# Altium schematic sheet BitFury.SchDoc
size A1
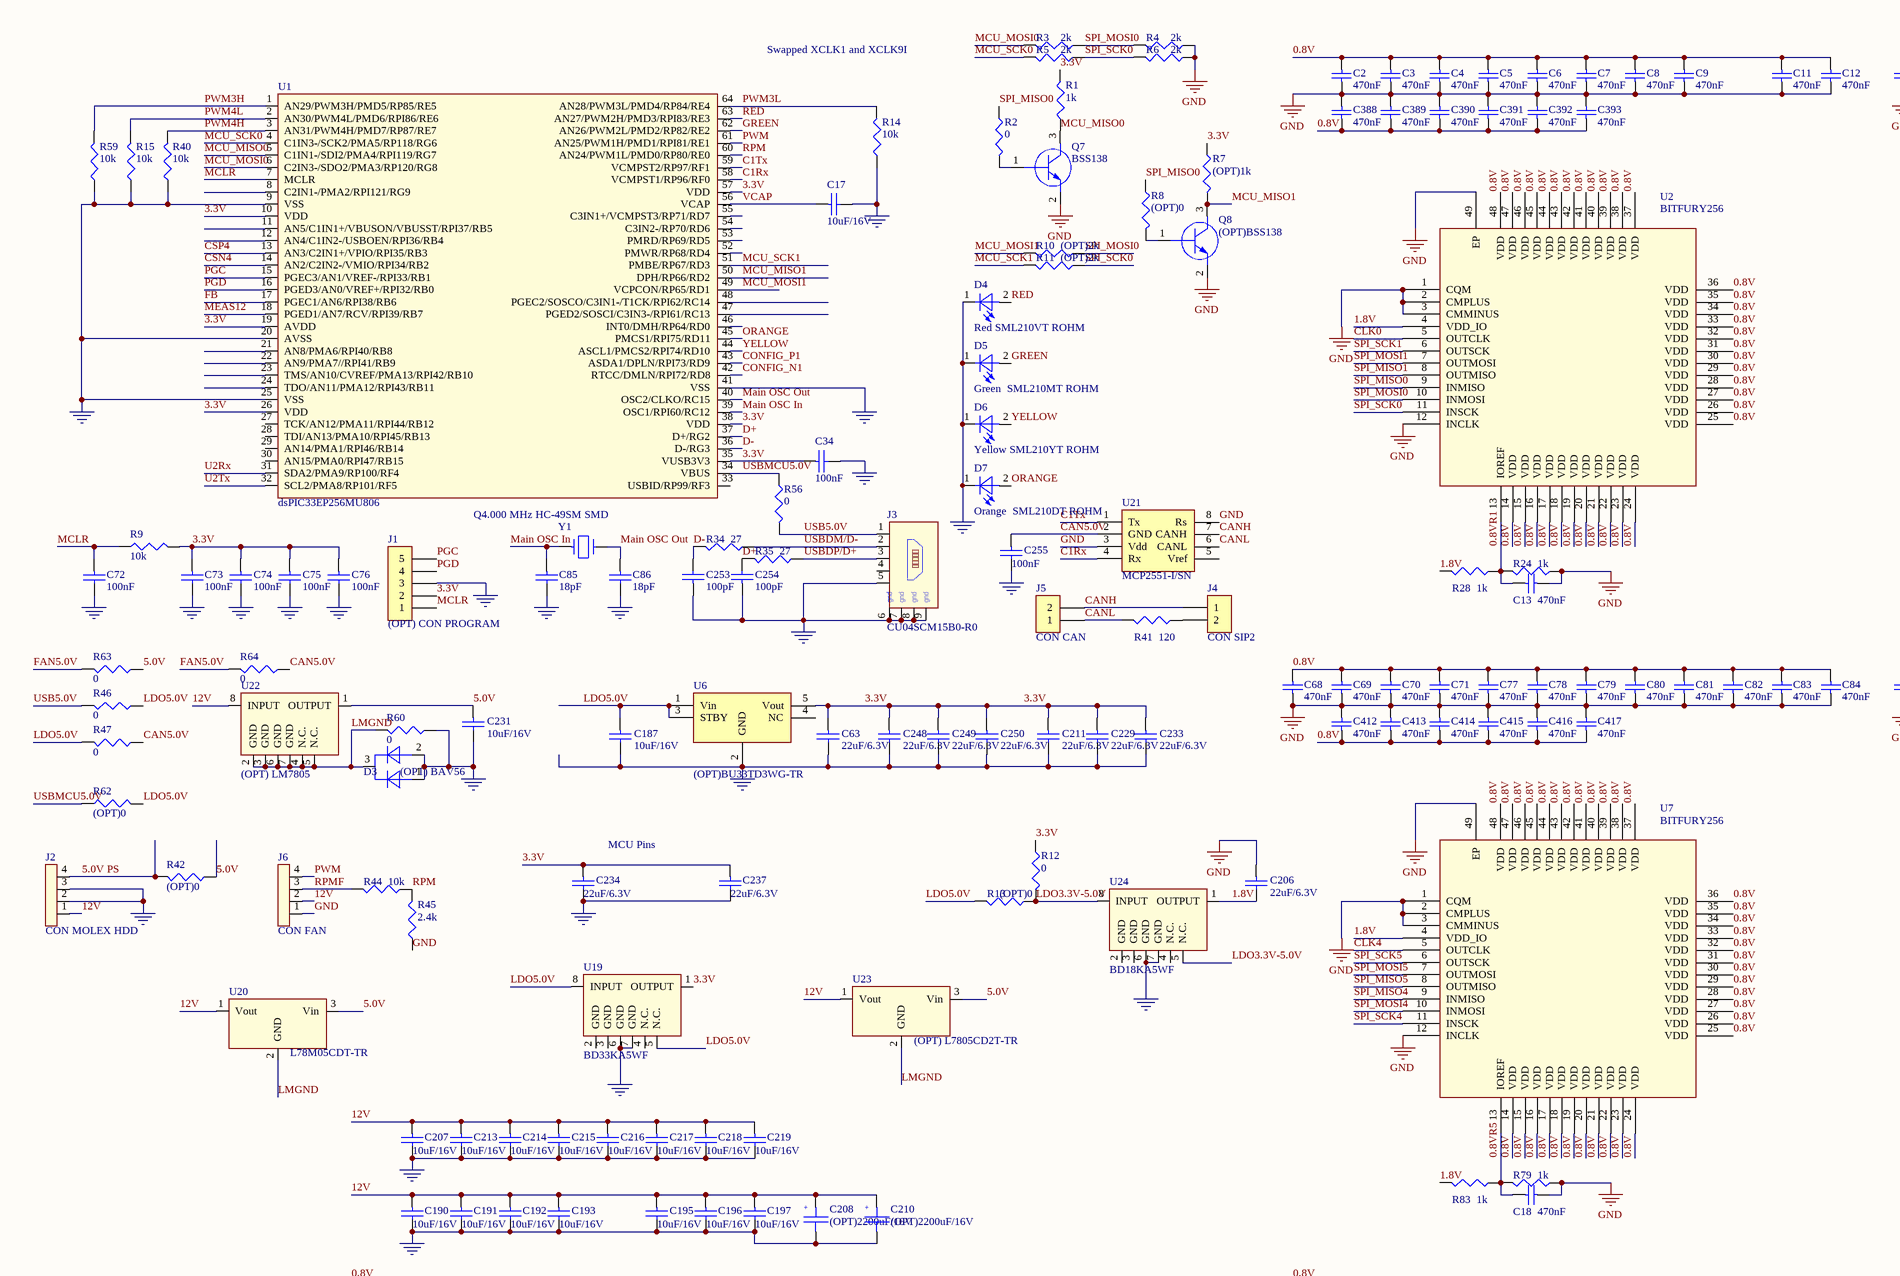
[diagram p0: BitFury.SchDoc, top left]
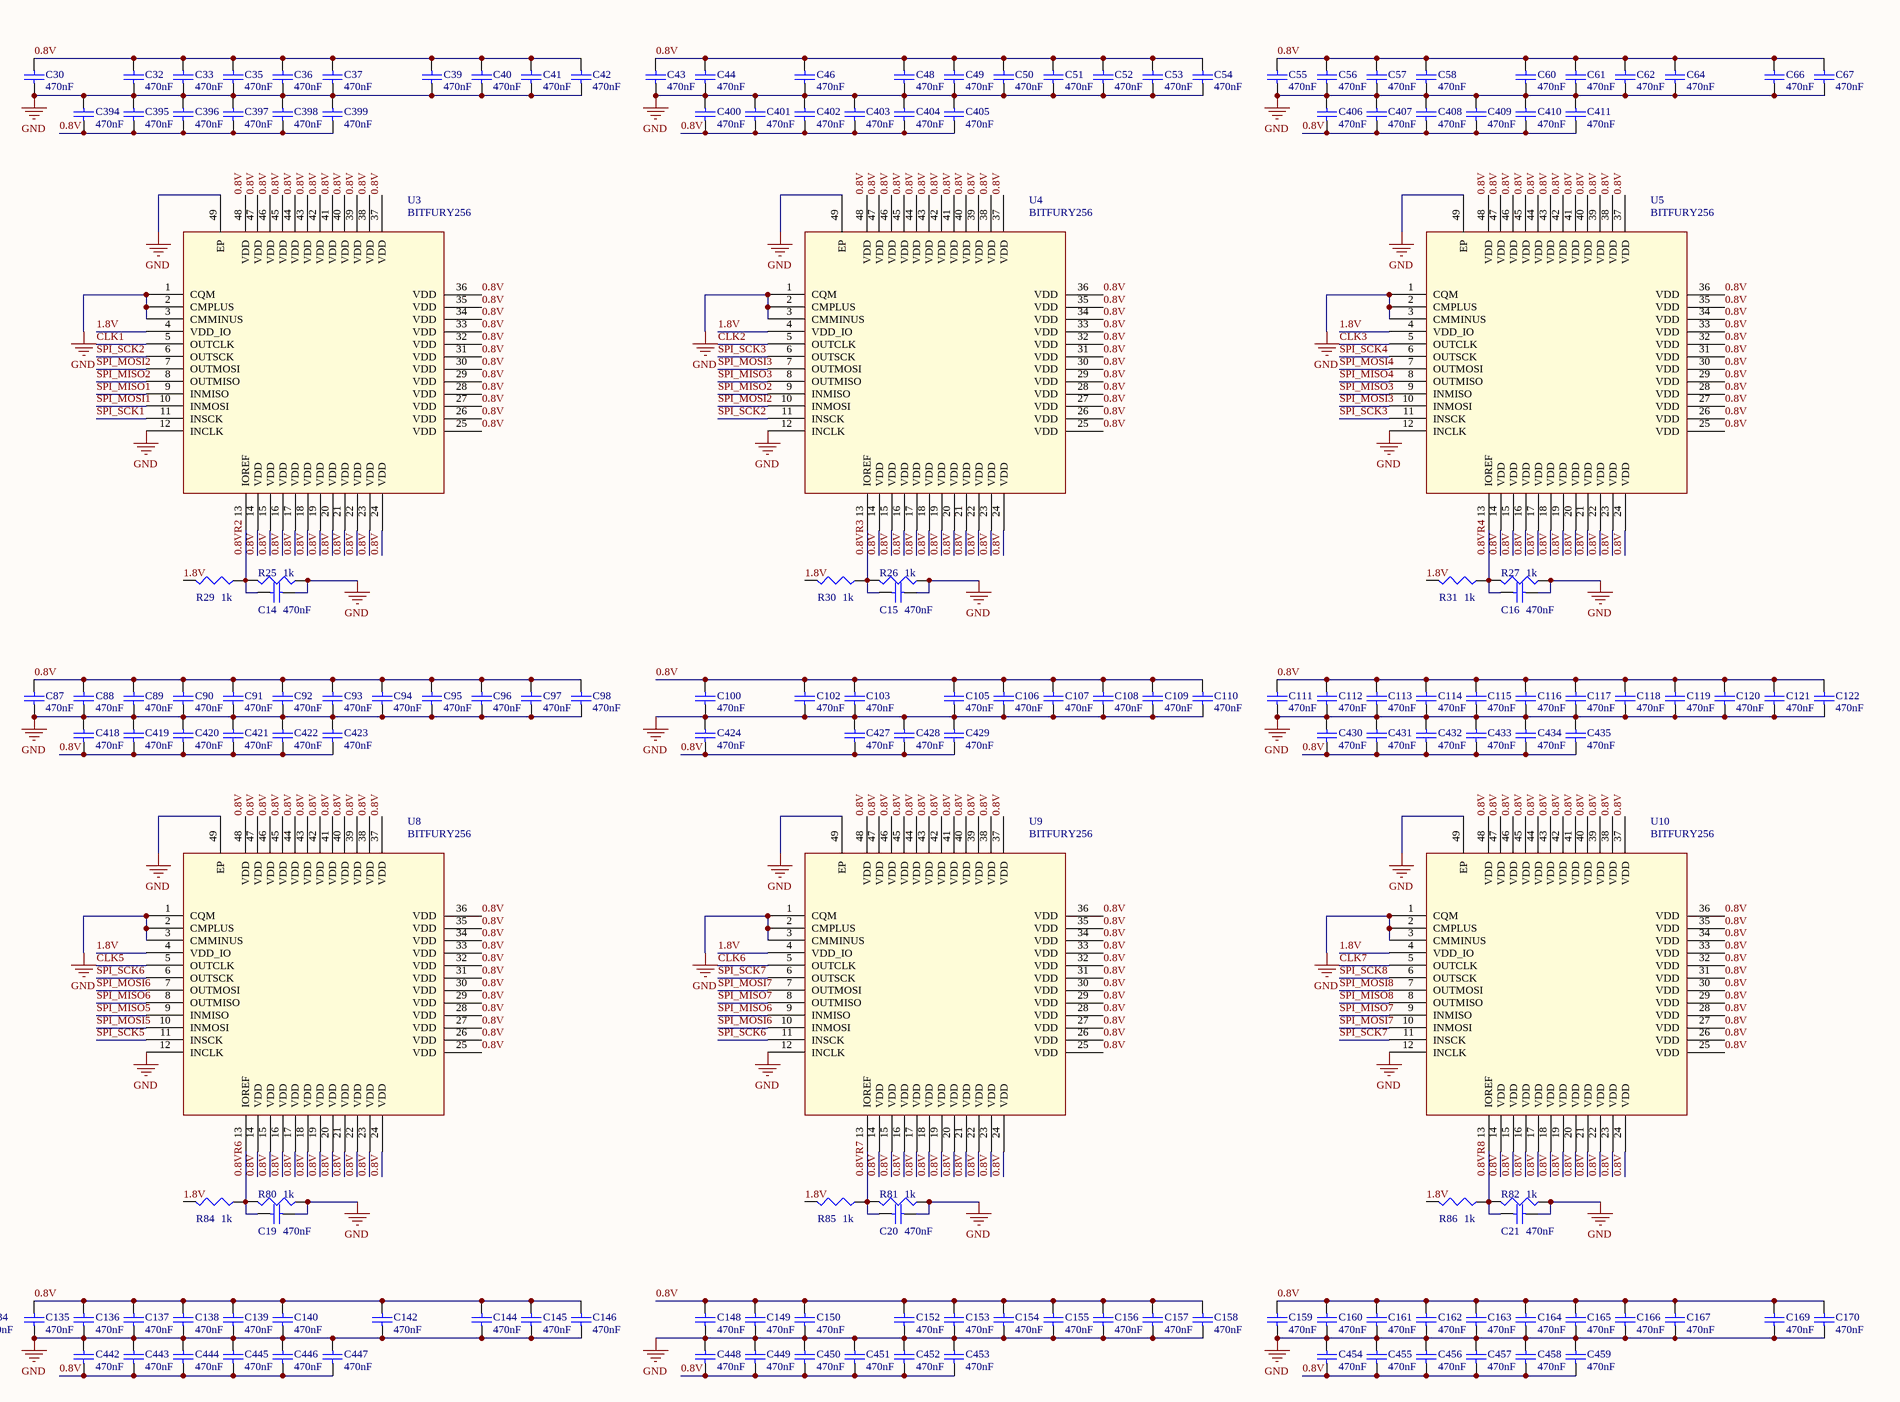
[diagram p1: BitFury.SchDoc, top right]
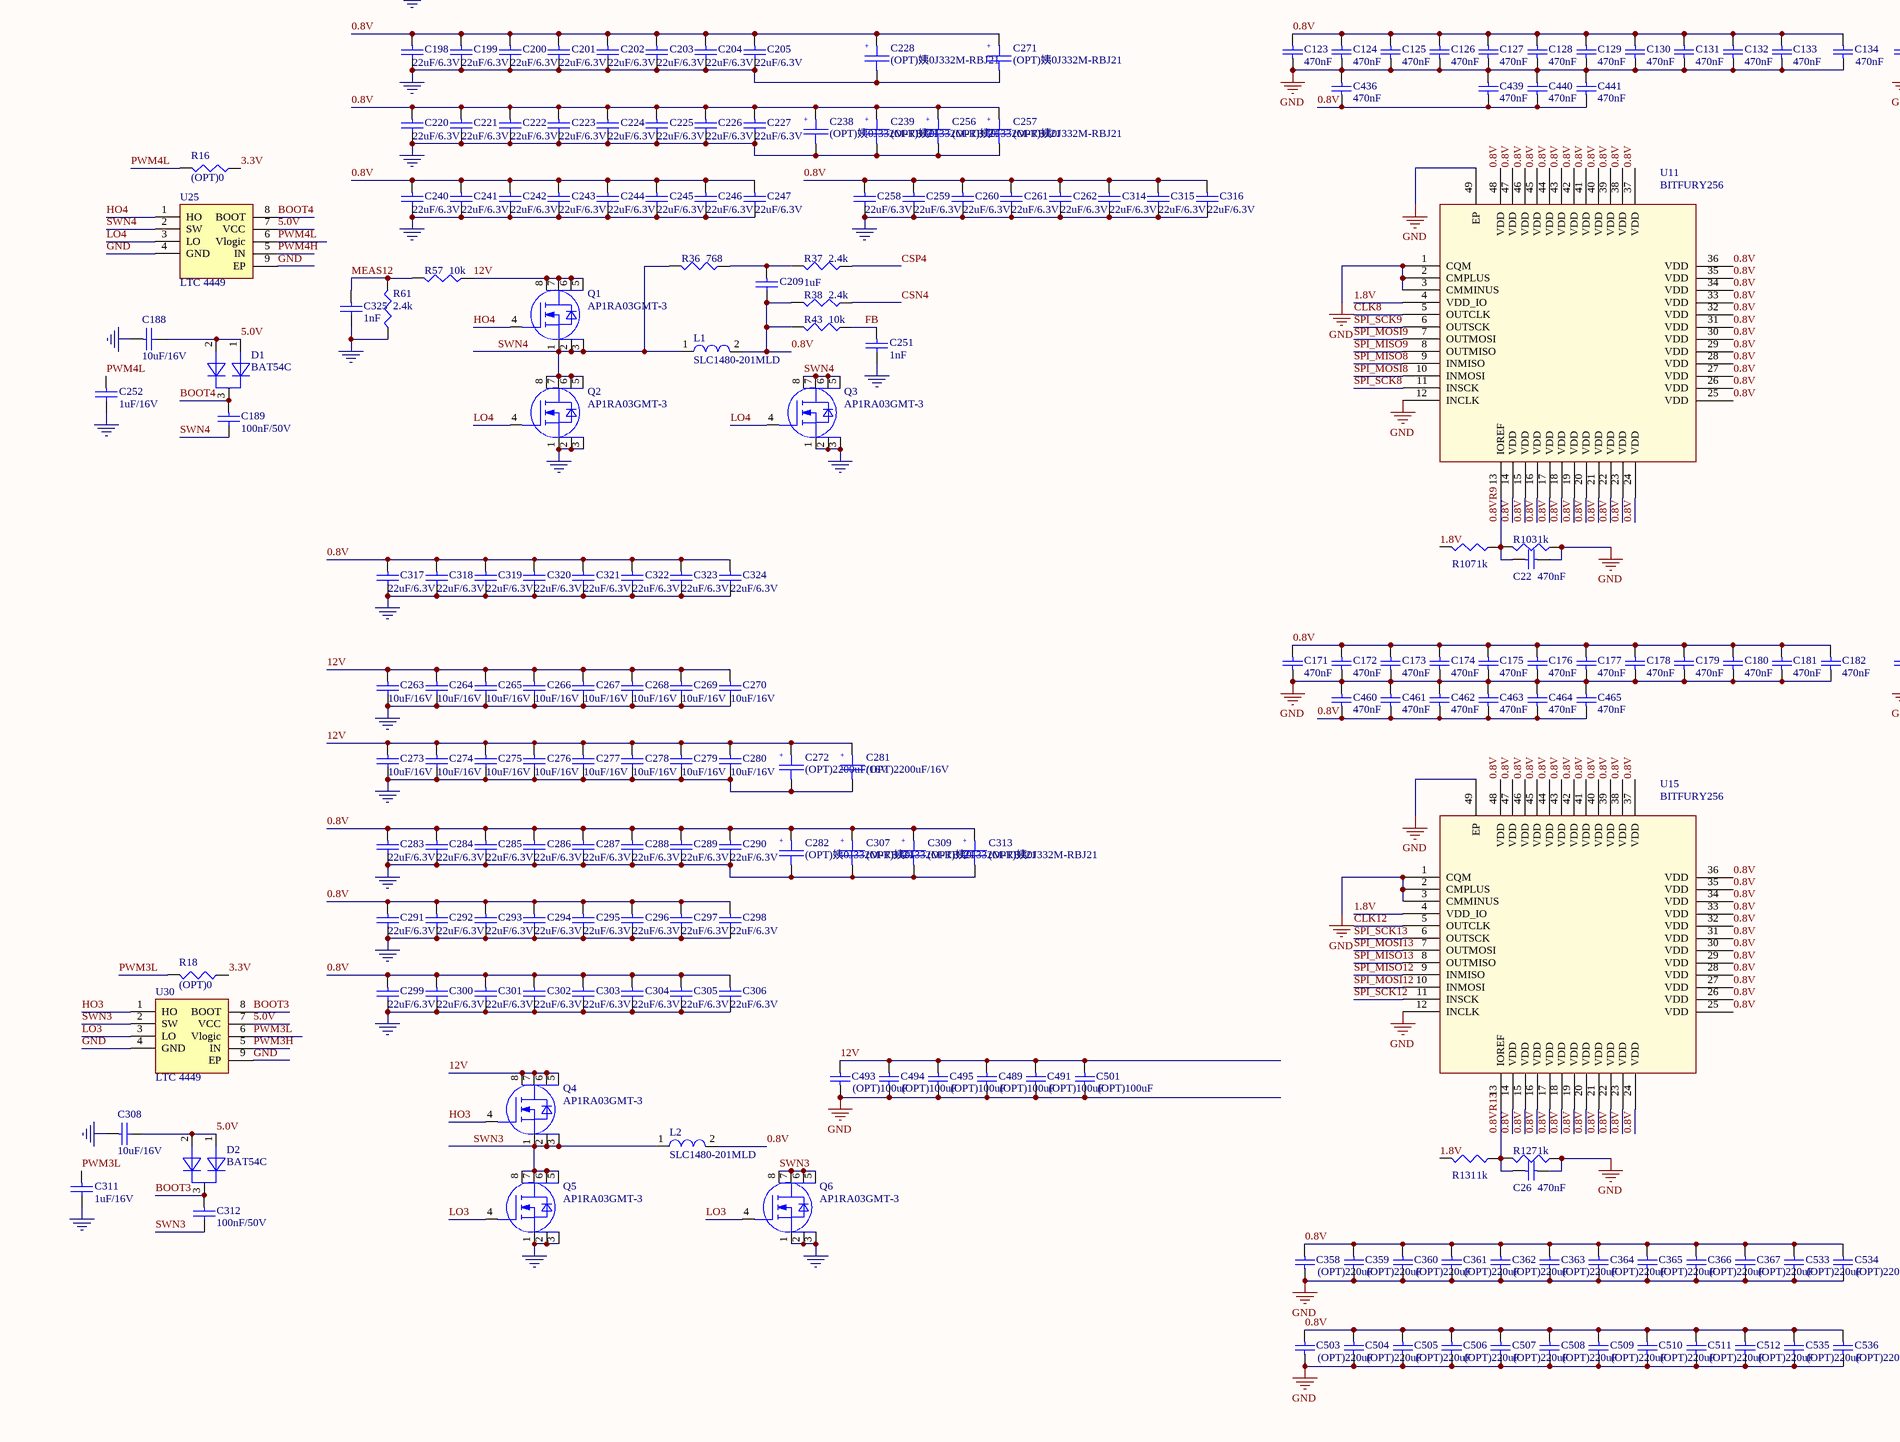
[diagram p2: BitFury.SchDoc, bottom left]
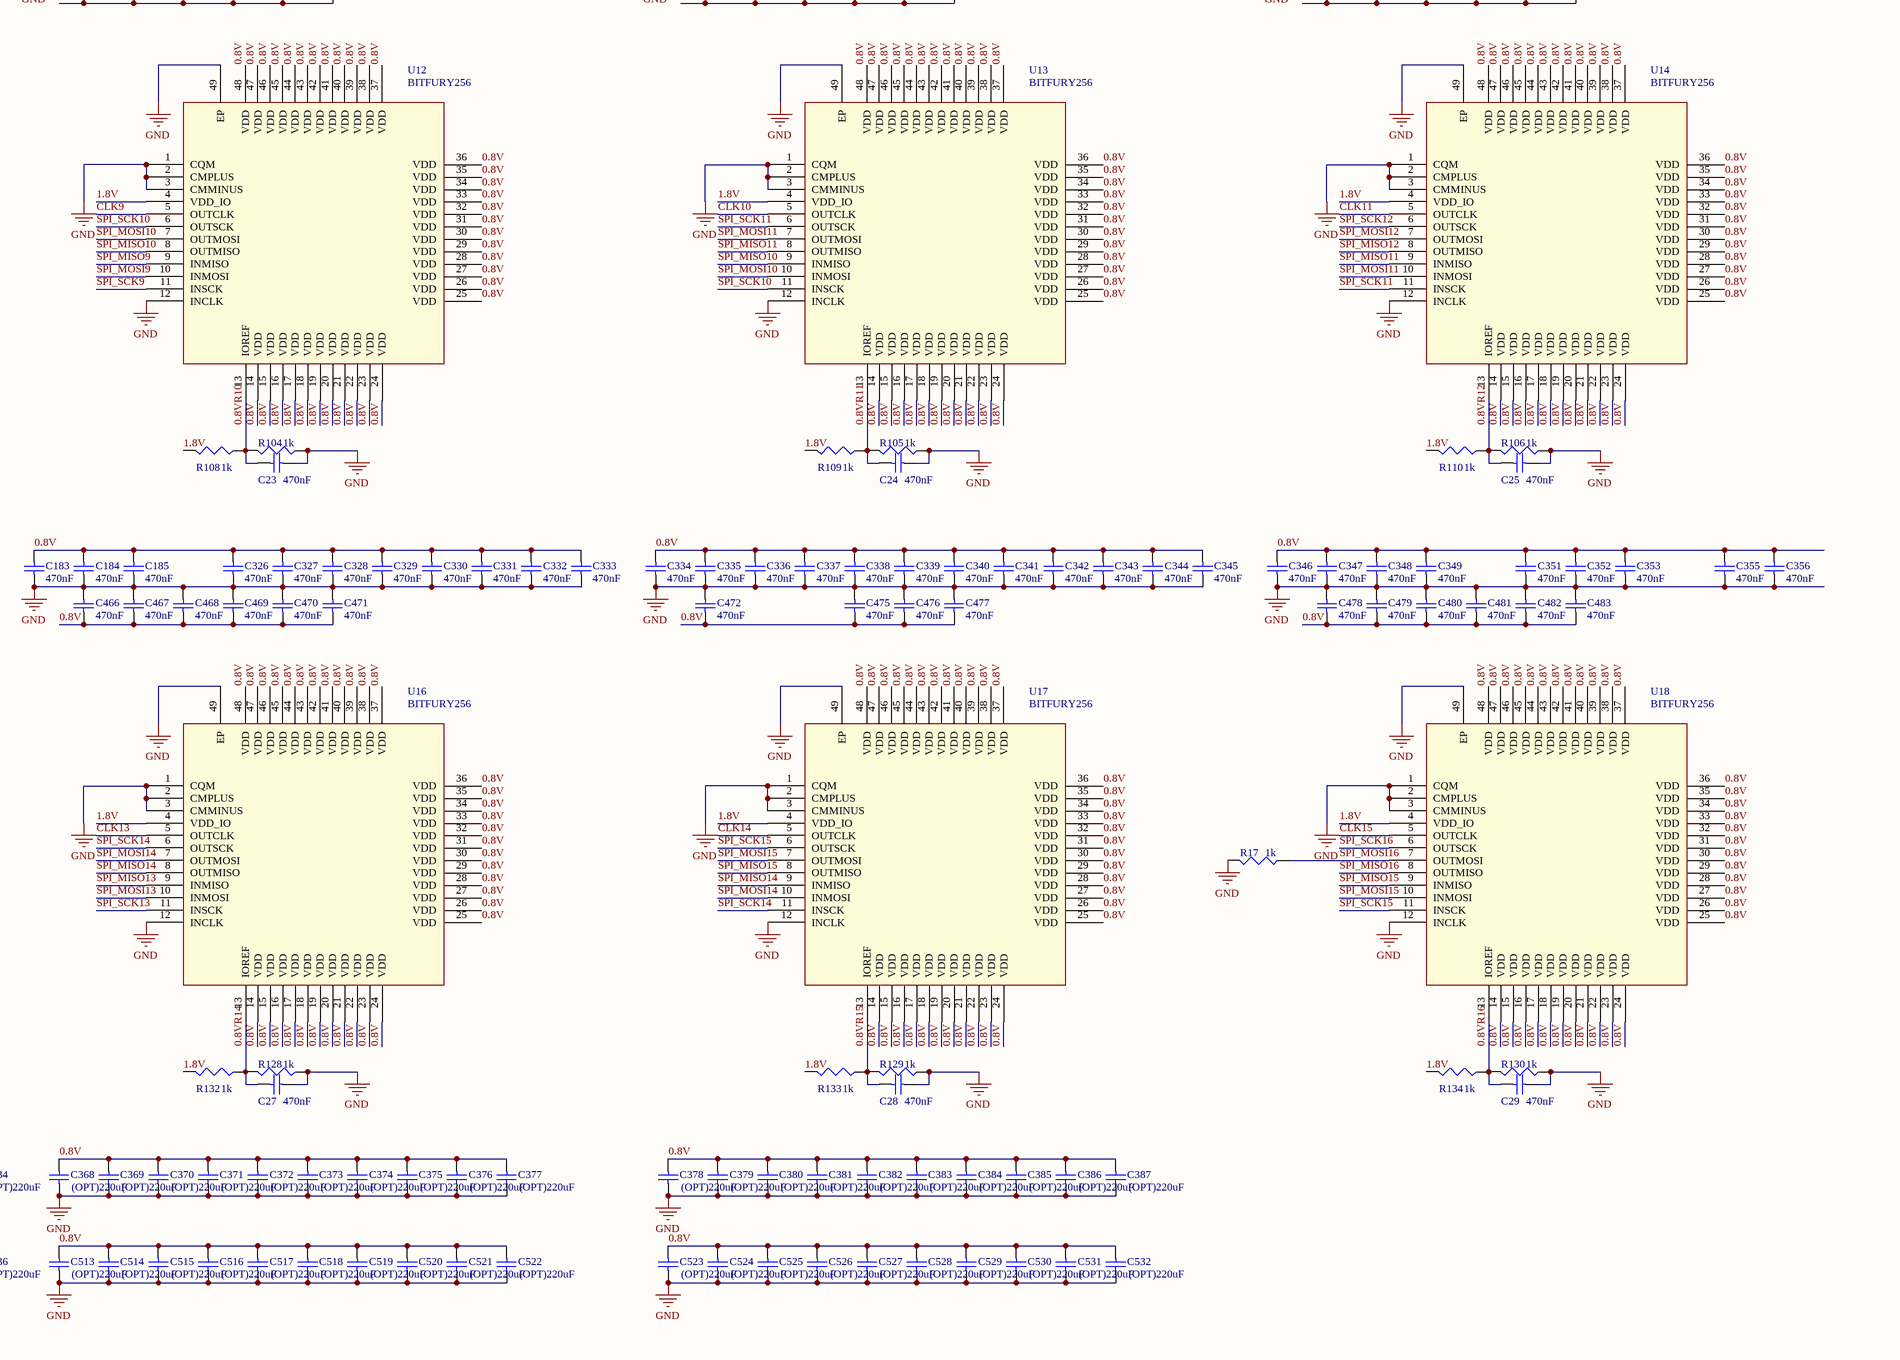
[diagram p3: BitFury.SchDoc, bottom right]

## Parts
C2  470nF  [SMD_0603_CAPC1608X80N]
C3  470nF  [SMD_0603_CAPC1608X80N]
C4  470nF  [SMD_0603_CAPC1608X80N]
C5  470nF  [SMD_0603_CAPC1608X80N]
C6  470nF  [SMD_0603_CAPC1608X80N]
C7  470nF  [SMD_0603_CAPC1608X80N]
C8  470nF  [SMD_0603_CAPC1608X80N]
C9  470nF  [SMD_0603_CAPC1608X80N]
C11  470nF  [SMD_0603_CAPC1608X80N]
C12  470nF  [SMD_0603_CAPC1608X80N]
C13  470nF  [SMD_0603_CAPC1608X80N]
C14  470nF  [SMD_0603_CAPC1608X80N]
C15  470nF  [SMD_0603_CAPC1608X80N]
C16  470nF  [SMD_0603_CAPC1608X80N]
C17  10uF/16V  [SMD_0805_CAPC2012X145N]
C18  470nF  [SMD_0603_CAPC1608X80N]
C19  470nF  [SMD_0603_CAPC1608X80N]
C20  470nF  [SMD_0603_CAPC1608X80N]
C21  470nF  [SMD_0603_CAPC1608X80N]
C22  470nF  [SMD_0603_CAPC1608X80N]
C23  470nF  [SMD_0603_CAPC1608X80N]
C24  470nF  [SMD_0603_CAPC1608X80N]
C25  470nF  [SMD_0603_CAPC1608X80N]
C26  470nF  [SMD_0603_CAPC1608X80N]
C27  470nF  [SMD_0603_CAPC1608X80N]
C28  470nF  [SMD_0603_CAPC1608X80N]
C29  470nF  [SMD_0603_CAPC1608X80N]
C30  470nF  [SMD_0603_CAPC1608X80N]
C32  470nF  [SMD_0603_CAPC1608X80N]
C33  470nF  [SMD_0603_CAPC1608X80N]
C34  100nF  [SMD_0603_CAPC1608X80N]
C35  470nF  [SMD_0603_CAPC1608X80N]
C36  470nF  [SMD_0603_CAPC1608X80N]
C37  470nF  [SMD_0603_CAPC1608X80N]
C39  470nF  [SMD_0603_CAPC1608X80N]
C40  470nF  [SMD_0603_CAPC1608X80N]
C41  470nF  [SMD_0603_CAPC1608X80N]
C42  470nF  [SMD_0603_CAPC1608X80N]
C43  470nF  [SMD_0603_CAPC1608X80N]
C44  470nF  [SMD_0603_CAPC1608X80N]
C46  470nF  [SMD_0603_CAPC1608X80N]
C48  470nF  [SMD_0603_CAPC1608X80N]
C49  470nF  [SMD_0603_CAPC1608X80N]
C50  470nF  [SMD_0603_CAPC1608X80N]
C51  470nF  [SMD_0603_CAPC1608X80N]
C52  470nF  [SMD_0603_CAPC1608X80N]
C53  470nF  [SMD_0603_CAPC1608X80N]
C54  470nF  [SMD_0603_CAPC1608X80N]
C55  470nF  [SMD_0603_CAPC1608X80N]
C56  470nF  [SMD_0603_CAPC1608X80N]
C57  470nF  [SMD_0603_CAPC1608X80N]
C58  470nF  [SMD_0603_CAPC1608X80N]
C60  470nF  [SMD_0603_CAPC1608X80N]
C61  470nF  [SMD_0603_CAPC1608X80N]
C62  470nF  [SMD_0603_CAPC1608X80N]
C63  22uF/6.3V  [SMD_0805_CAPC2012X145N]
C64  470nF  [SMD_0603_CAPC1608X80N]
C66  470nF  [SMD_0603_CAPC1608X80N]
C67  470nF  [SMD_0603_CAPC1608X80N]
C68  470nF  [SMD_0603_CAPC1608X80N]
C69  470nF  [SMD_0603_CAPC1608X80N]
C70  470nF  [SMD_0603_CAPC1608X80N]
C71  470nF  [SMD_0603_CAPC1608X80N]
C72  100nF  [SMD_0603_CAPC1608X80N]
C73  100nF  [SMD_0603_CAPC1608X80N]
C74  100nF  [SMD_0603_CAPC1608X80N]
C75  100nF  [SMD_0603_CAPC1608X80N]
C76  100nF  [SMD_0603_CAPC1608X80N]
C77  470nF  [SMD_0603_CAPC1608X80N]
C78  470nF  [SMD_0603_CAPC1608X80N]
C79  470nF  [SMD_0603_CAPC1608X80N]
C80  470nF  [SMD_0603_CAPC1608X80N]
C81  470nF  [SMD_0603_CAPC1608X80N]
C82  470nF  [SMD_0603_CAPC1608X80N]
C83  470nF  [SMD_0603_CAPC1608X80N]
C84  470nF  [SMD_0603_CAPC1608X80N]
C85  18pF  [SMD_0603_CAPC1608X80N]
C86  18pF  [SMD_0603_CAPC1608X80N]
C87  470nF  [SMD_0603_CAPC1608X80N]
C88  470nF  [SMD_0603_CAPC1608X80N]
C89  470nF  [SMD_0603_CAPC1608X80N]
C90  470nF  [SMD_0603_CAPC1608X80N]
C91  470nF  [SMD_0603_CAPC1608X80N]
C92  470nF  [SMD_0603_CAPC1608X80N]
C93  470nF  [SMD_0603_CAPC1608X80N]
C94  470nF  [SMD_0603_CAPC1608X80N]
C95  470nF  [SMD_0603_CAPC1608X80N]
C96  470nF  [SMD_0603_CAPC1608X80N]
C97  470nF  [SMD_0603_CAPC1608X80N]
C98  470nF  [SMD_0603_CAPC1608X80N]
C100  470nF  [SMD_0603_CAPC1608X80N]
C102  470nF  [SMD_0603_CAPC1608X80N]
C103  470nF  [SMD_0603_CAPC1608X80N]
C105  470nF  [SMD_0603_CAPC1608X80N]
C106  470nF  [SMD_0603_CAPC1608X80N]
C107  470nF  [SMD_0603_CAPC1608X80N]
C108  470nF  [SMD_0603_CAPC1608X80N]
C109  470nF  [SMD_0603_CAPC1608X80N]
C110  470nF  [SMD_0603_CAPC1608X80N]
C111  470nF  [SMD_0603_CAPC1608X80N]
C112  470nF  [SMD_0603_CAPC1608X80N]
C113  470nF  [SMD_0603_CAPC1608X80N]
C114  470nF  [SMD_0603_CAPC1608X80N]
C115  470nF  [SMD_0603_CAPC1608X80N]
C116  470nF  [SMD_0603_CAPC1608X80N]
C117  470nF  [SMD_0603_CAPC1608X80N]
C118  470nF  [SMD_0603_CAPC1608X80N]
C119  470nF  [SMD_0603_CAPC1608X80N]
C120  470nF  [SMD_0603_CAPC1608X80N]
C121  470nF  [SMD_0603_CAPC1608X80N]
C122  470nF  [SMD_0603_CAPC1608X80N]
C123  470nF  [SMD_0603_CAPC1608X80N]
C124  470nF  [SMD_0603_CAPC1608X80N]
C125  470nF  [SMD_0603_CAPC1608X80N]
C126  470nF  [SMD_0603_CAPC1608X80N]
C127  470nF  [SMD_0603_CAPC1608X80N]
C128  470nF  [SMD_0603_CAPC1608X80N]
C129  470nF  [SMD_0603_CAPC1608X80N]
C130  470nF  [SMD_0603_CAPC1608X80N]
C131  470nF  [SMD_0603_CAPC1608X80N]
C132  470nF  [SMD_0603_CAPC1608X80N]
C133  470nF  [SMD_0603_CAPC1608X80N]
C134  470nF  [SMD_0603_CAPC1608X80N]
C135  470nF  [SMD_0603_CAPC1608X80N]
C136  470nF  [SMD_0603_CAPC1608X80N]
C137  470nF  [SMD_0603_CAPC1608X80N]
C138  470nF  [SMD_0603_CAPC1608X80N]
C139  470nF  [SMD_0603_CAPC1608X80N]
C140  470nF  [SMD_0603_CAPC1608X80N]
C142  470nF  [SMD_0603_CAPC1608X80N]
C144  470nF  [SMD_0603_CAPC1608X80N]
C145  470nF  [SMD_0603_CAPC1608X80N]
C146  470nF  [SMD_0603_CAPC1608X80N]
C148  470nF  [SMD_0603_CAPC1608X80N]
C149  470nF  [SMD_0603_CAPC1608X80N]
C150  470nF  [SMD_0603_CAPC1608X80N]
C152  470nF  [SMD_0603_CAPC1608X80N]
C153  470nF  [SMD_0603_CAPC1608X80N]
C154  470nF  [SMD_0603_CAPC1608X80N]
C155  470nF  [SMD_0603_CAPC1608X80N]
C156  470nF  [SMD_0603_CAPC1608X80N]
C157  470nF  [SMD_0603_CAPC1608X80N]
C158  470nF  [SMD_0603_CAPC1608X80N]
C159  470nF  [SMD_0603_CAPC1608X80N]
C160  470nF  [SMD_0603_CAPC1608X80N]
C161  470nF  [SMD_0603_CAPC1608X80N]
C162  470nF  [SMD_0603_CAPC1608X80N]
C163  470nF  [SMD_0603_CAPC1608X80N]
C164  470nF  [SMD_0603_CAPC1608X80N]
C165  470nF  [SMD_0603_CAPC1608X80N]
C166  470nF  [SMD_0603_CAPC1608X80N]
C167  470nF  [SMD_0603_CAPC1608X80N]
C169  470nF  [SMD_0603_CAPC1608X80N]
C170  470nF  [SMD_0603_CAPC1608X80N]
C171  470nF  [SMD_0603_CAPC1608X80N]
C172  470nF  [SMD_0603_CAPC1608X80N]
C173  470nF  [SMD_0603_CAPC1608X80N]
C174  470nF  [SMD_0603_CAPC1608X80N]
C175  470nF  [SMD_0603_CAPC1608X80N]
C176  470nF  [SMD_0603_CAPC1608X80N]
C177  470nF  [SMD_0603_CAPC1608X80N]
C178  470nF  [SMD_0603_CAPC1608X80N]
C179  470nF  [SMD_0603_CAPC1608X80N]
C180  470nF  [SMD_0603_CAPC1608X80N]
C181  470nF  [SMD_0603_CAPC1608X80N]
C182  470nF  [SMD_0603_CAPC1608X80N]
C183  470nF  [SMD_0603_CAPC1608X80N]
C184  470nF  [SMD_0603_CAPC1608X80N]
C185  470nF  [SMD_0603_CAPC1608X80N]
C187  10uF/16V  [SMD_0805_CAPC2012X145N]
C188  10uF/16V  [SMD_0805_CAPC2012X145N]
C189  100nF/50V  [SMD_0805_CAPC2012X145N]
C190  10uF/16V  [SMD_0805_CAPC2012X145N]
C191  10uF/16V  [SMD_0805_CAPC2012X145N]
C192  10uF/16V  [SMD_0805_CAPC2012X145N]
C193  10uF/16V  [SMD_0805_CAPC2012X145N]
C195  10uF/16V  [SMD_0805_CAPC2012X145N]
C196  10uF/16V  [SMD_0805_CAPC2012X145N]
C197  10uF/16V  [SMD_0805_CAPC2012X145N]
C198  22uF/6.3V  [SMD_0805_CAPC2012X145N]
C199  22uF/6.3V  [SMD_0805_CAPC2012X145N]
C200  22uF/6.3V  [SMD_0805_CAPC2012X145N]
C201  22uF/6.3V  [SMD_0805_CAPC2012X145N]
C202  22uF/6.3V  [SMD_0805_CAPC2012X145N]
C203  22uF/6.3V  [SMD_0805_CAPC2012X145N]
C204  22uF/6.3V  [SMD_0805_CAPC2012X145N]
C205  22uF/6.3V  [SMD_0805_CAPC2012X145N]
C206  22uF/6.3V  [SMD_0805_CAPC2012X145N]
C207  10uF/16V  [SMD_0805_CAPC2012X145N]
C208  (OPT)2200uF/16V  [PTH_CAPPR500-1300X2250]
C209  1uF  [SMD_0805_CAPC2012X145N]
C210  (OPT)2200uF/16V  [PTH_CAPPR500-1300X2250]
C211  22uF/6.3V  [SMD_0805_CAPC2012X145N]
C213  10uF/16V  [SMD_0805_CAPC2012X145N]
C214  10uF/16V  [SMD_0805_CAPC2012X145N]
C215  10uF/16V  [SMD_0805_CAPC2012X145N]
C216  10uF/16V  [SMD_0805_CAPC2012X145N]
C217  10uF/16V  [SMD_0805_CAPC2012X145N]
C218  10uF/16V  [SMD_0805_CAPC2012X145N]
C219  10uF/16V  [SMD_0805_CAPC2012X145N]
C220  22uF/6.3V  [SMD_0805_CAPC2012X145N]
C221  22uF/6.3V  [SMD_0805_CAPC2012X145N]
C222  22uF/6.3V  [SMD_0805_CAPC2012X145N]
C223  22uF/6.3V  [SMD_0805_CAPC2012X145N]
C224  22uF/6.3V  [SMD_0805_CAPC2012X145N]
C225  22uF/6.3V  [SMD_0805_CAPC2012X145N]
C226  22uF/6.3V  [SMD_0805_CAPC2012X145N]
C227  22uF/6.3V  [SMD_0805_CAPC2012X145N]
C228  (OPT)姨0J332M-RBJ21  [PTH_CAPPR500-1300X2250]
C229  22uF/6.3V  [SMD_0805_CAPC2012X145N]
C231  10uF/16V  [SMD_0805_CAPC2012X145N]
C233  22uF/6.3V  [SMD_0805_CAPC2012X145N]
C234  22uF/6.3V  [SMD_0805_CAPC2012X145N]
C237  22uF/6.3V  [SMD_0805_CAPC2012X145N]
C238  (OPT)姨0J332M-RBJ21  [PTH_CAPPR500-1300X2250]
C239  (OPT)姨0J332M-RBJ21  [PTH_CAPPR500-1300X2250]
C240  22uF/6.3V  [SMD_0805_CAPC2012X145N]
C241  22uF/6.3V  [SMD_0805_CAPC2012X145N]
C242  22uF/6.3V  [SMD_0805_CAPC2012X145N]
C243  22uF/6.3V  [SMD_0805_CAPC2012X145N]
C244  22uF/6.3V  [SMD_0805_CAPC2012X145N]
C245  22uF/6.3V  [SMD_0805_CAPC2012X145N]
C246  22uF/6.3V  [SMD_0805_CAPC2012X145N]
C247  22uF/6.3V  [SMD_0805_CAPC2012X145N]
C248  22uF/6.3V  [SMD_0805_CAPC2012X145N]
C249  22uF/6.3V  [SMD_0805_CAPC2012X145N]
C250  22uF/6.3V  [SMD_0805_CAPC2012X145N]
C251  1nF  [SMD_0603_CAPC1608X80N]
C252  1uF/16V  [SMD_0805_CAPC2012X145N]
C253  100pF  [SMD_0603_CAPC1608X80N]
C254  100pF  [SMD_0603_CAPC1608X80N]
C255  100nF  [SMD_0603_CAPC1608X80N]
C256  (OPT)姨0J332M-RBJ21  [PTH_CAPPR500-1300X2250]
C257  (OPT)姨0J332M-RBJ21  [PTH_CAPPR500-1300X2250]
C258  22uF/6.3V  [SMD_0805_CAPC2012X145N]
C259  22uF/6.3V  [SMD_0805_CAPC2012X145N]
C260  22uF/6.3V  [SMD_0805_CAPC2012X145N]
C261  22uF/6.3V  [SMD_0805_CAPC2012X145N]
C262  22uF/6.3V  [SMD_0805_CAPC2012X145N]
C263  10uF/16V  [SMD_0805_CAPC2012X145N]
C264  10uF/16V  [SMD_0805_CAPC2012X145N]
C265  10uF/16V  [SMD_0805_CAPC2012X145N]
C266  10uF/16V  [SMD_0805_CAPC2012X145N]
C267  10uF/16V  [SMD_0805_CAPC2012X145N]
C268  10uF/16V  [SMD_0805_CAPC2012X145N]
C269  10uF/16V  [SMD_0805_CAPC2012X145N]
C270  10uF/16V  [SMD_0805_CAPC2012X145N]
C271  (OPT)姨0J332M-RBJ21  [PTH_CAPPR500-1300X2250]
C272  (OPT)2200uF/16V  [PTH_CAPPR500-1300X2250]
C273  10uF/16V  [SMD_0805_CAPC2012X145N]
C274  10uF/16V  [SMD_0805_CAPC2012X145N]
C275  10uF/16V  [SMD_0805_CAPC2012X145N]
C276  10uF/16V  [SMD_0805_CAPC2012X145N]
C277  10uF/16V  [SMD_0805_CAPC2012X145N]
C278  10uF/16V  [SMD_0805_CAPC2012X145N]
C279  10uF/16V  [SMD_0805_CAPC2012X145N]
C280  10uF/16V  [SMD_0805_CAPC2012X145N]
C281  (OPT)2200uF/16V  [PTH_CAPPR500-1300X2250]
C282  (OPT)姨0J332M-RBJ21  [PTH_CAPPR500-1300X2250]
C283  22uF/6.3V  [SMD_0805_CAPC2012X145N]
C284  22uF/6.3V  [SMD_0805_CAPC2012X145N]
C285  22uF/6.3V  [SMD_0805_CAPC2012X145N]
C286  22uF/6.3V  [SMD_0805_CAPC2012X145N]
C287  22uF/6.3V  [SMD_0805_CAPC2012X145N]
C288  22uF/6.3V  [SMD_0805_CAPC2012X145N]
C289  22uF/6.3V  [SMD_0805_CAPC2012X145N]
C290  22uF/6.3V  [SMD_0805_CAPC2012X145N]
C291  22uF/6.3V  [SMD_0805_CAPC2012X145N]
C292  22uF/6.3V  [SMD_0805_CAPC2012X145N]
C293  22uF/6.3V  [SMD_0805_CAPC2012X145N]
C294  22uF/6.3V  [SMD_0805_CAPC2012X145N]
C295  22uF/6.3V  [SMD_0805_CAPC2012X145N]
C296  22uF/6.3V  [SMD_0805_CAPC2012X145N]
C297  22uF/6.3V  [SMD_0805_CAPC2012X145N]
C298  22uF/6.3V  [SMD_0805_CAPC2012X145N]
C299  22uF/6.3V  [SMD_0805_CAPC2012X145N]
C300  22uF/6.3V  [SMD_0805_CAPC2012X145N]
C301  22uF/6.3V  [SMD_0805_CAPC2012X145N]
C302  22uF/6.3V  [SMD_0805_CAPC2012X145N]
C303  22uF/6.3V  [SMD_0805_CAPC2012X145N]
C304  22uF/6.3V  [SMD_0805_CAPC2012X145N]
C305  22uF/6.3V  [SMD_0805_CAPC2012X145N]
C306  22uF/6.3V  [SMD_0805_CAPC2012X145N]
C307  (OPT)姨0J332M-RBJ21  [PTH_CAPPR500-1300X2250]
C308  10uF/16V  [SMD_0805_CAPC2012X145N]
C309  (OPT)姨0J332M-RBJ21  [PTH_CAPPR500-1300X2250]
C311  1uF/16V  [SMD_0805_CAPC2012X145N]
C312  100nF/50V  [SMD_0805_CAPC2012X145N]
C313  (OPT)姨0J332M-RBJ21  [PTH_CAPPR500-1300X2250]
C314  22uF/6.3V  [SMD_0805_CAPC2012X145N]
C315  22uF/6.3V  [SMD_0805_CAPC2012X145N]
C316  22uF/6.3V  [SMD_0805_CAPC2012X145N]
C317  22uF/6.3V  [SMD_0805_CAPC2012X145N]
C318  22uF/6.3V  [SMD_0805_CAPC2012X145N]
C319  22uF/6.3V  [SMD_0805_CAPC2012X145N]
C320  22uF/6.3V  [SMD_0805_CAPC2012X145N]
C321  22uF/6.3V  [SMD_0805_CAPC2012X145N]
C322  22uF/6.3V  [SMD_0805_CAPC2012X145N]
C323  22uF/6.3V  [SMD_0805_CAPC2012X145N]
C324  22uF/6.3V  [SMD_0805_CAPC2012X145N]
C325  1nF  [SMD_0603_CAPC1608X80N]
C326  470nF  [SMD_0603_CAPC1608X80N]
C327  470nF  [SMD_0603_CAPC1608X80N]
C328  470nF  [SMD_0603_CAPC1608X80N]
C329  470nF  [SMD_0603_CAPC1608X80N]
C330  470nF  [SMD_0603_CAPC1608X80N]
C331  470nF  [SMD_0603_CAPC1608X80N]
C332  470nF  [SMD_0603_CAPC1608X80N]
C333  470nF  [SMD_0603_CAPC1608X80N]
C334  470nF  [SMD_0603_CAPC1608X80N]
C335  470nF  [SMD_0603_CAPC1608X80N]
C336  470nF  [SMD_0603_CAPC1608X80N]
C337  470nF  [SMD_0603_CAPC1608X80N]
C338  470nF  [SMD_0603_CAPC1608X80N]
C339  470nF  [SMD_0603_CAPC1608X80N]
C340  470nF  [SMD_0603_CAPC1608X80N]
C341  470nF  [SMD_0603_CAPC1608X80N]
C342  470nF  [SMD_0603_CAPC1608X80N]
C343  470nF  [SMD_0603_CAPC1608X80N]
C344  470nF  [SMD_0603_CAPC1608X80N]
C345  470nF  [SMD_0603_CAPC1608X80N]
C346  470nF  [SMD_0603_CAPC1608X80N]
C347  470nF  [SMD_0603_CAPC1608X80N]
C348  470nF  [SMD_0603_CAPC1608X80N]
C349  470nF  [SMD_0603_CAPC1608X80N]
C351  470nF  [SMD_0603_CAPC1608X80N]
C352  470nF  [SMD_0603_CAPC1608X80N]
C353  470nF  [SMD_0603_CAPC1608X80N]
C355  470nF  [SMD_0603_CAPC1608X80N]
C356  470nF  [SMD_0603_CAPC1608X80N]
C358  (OPT)220uF  [SMD_1210_CAPC3225X279N]
C359  (OPT)220uF  [SMD_1210_CAPC3225X279N]
C360  (OPT)220uF  [SMD_1210_CAPC3225X279N]
C361  (OPT)220uF  [SMD_1210_CAPC3225X279N]
C362  (OPT)220uF  [SMD_1210_CAPC3225X279N]
C363  (OPT)220uF  [SMD_1210_CAPC3225X279N]
C364  (OPT)220uF  [SMD_1210_CAPC3225X279N]
C365  (OPT)220uF  [SMD_1210_CAPC3225X279N]
C366  (OPT)220uF  [SMD_1210_CAPC3225X279N]
C367  (OPT)220uF  [SMD_1210_CAPC3225X279N]
C368  (OPT)220uF  [SMD_1210_CAPC3225X279N]
C369  (OPT)220uF  [SMD_1210_CAPC3225X279N]
C370  (OPT)220uF  [SMD_1210_CAPC3225X279N]
C371  (OPT)220uF  [SMD_1210_CAPC3225X279N]
C372  (OPT)220uF  [SMD_1210_CAPC3225X279N]
C373  (OPT)220uF  [SMD_1210_CAPC3225X279N]
C374  (OPT)220uF  [SMD_1210_CAPC3225X279N]
C375  (OPT)220uF  [SMD_1210_CAPC3225X279N]
C376  (OPT)220uF  [SMD_1210_CAPC3225X279N]
C377  (OPT)220uF  [SMD_1210_CAPC3225X279N]
C378  (OPT)220uF  [SMD_1210_CAPC3225X279N]
C379  (OPT)220uF  [SMD_1210_CAPC3225X279N]
C380  (OPT)220uF  [SMD_1210_CAPC3225X279N]
C381  (OPT)220uF  [SMD_1210_CAPC3225X279N]
C382  (OPT)220uF  [SMD_1210_CAPC3225X279N]
C383  (OPT)220uF  [SMD_1210_CAPC3225X279N]
C384  (OPT)220uF  [SMD_1210_CAPC3225X279N]
C385  (OPT)220uF  [SMD_1210_CAPC3225X279N]
C386  (OPT)220uF  [SMD_1210_CAPC3225X279N]
C387  (OPT)220uF  [SMD_1210_CAPC3225X279N]
C388  470nF  [SMD_0603_CAPC1608X80N]
C389  470nF  [SMD_0603_CAPC1608X80N]
C390  470nF  [SMD_0603_CAPC1608X80N]
C391  470nF  [SMD_0603_CAPC1608X80N]
C392  470nF  [SMD_0603_CAPC1608X80N]
C393  470nF  [SMD_0603_CAPC1608X80N]
C394  470nF  [SMD_0603_CAPC1608X80N]
C395  470nF  [SMD_0603_CAPC1608X80N]
C396  470nF  [SMD_0603_CAPC1608X80N]
C397  470nF  [SMD_0603_CAPC1608X80N]
C398  470nF  [SMD_0603_CAPC1608X80N]
C399  470nF  [SMD_0603_CAPC1608X80N]
C400  470nF  [SMD_0603_CAPC1608X80N]
C401  470nF  [SMD_0603_CAPC1608X80N]
C402  470nF  [SMD_0603_CAPC1608X80N]
C403  470nF  [SMD_0603_CAPC1608X80N]
C404  470nF  [SMD_0603_CAPC1608X80N]
C405  470nF  [SMD_0603_CAPC1608X80N]
C406  470nF  [SMD_0603_CAPC1608X80N]
C407  470nF  [SMD_0603_CAPC1608X80N]
C408  470nF  [SMD_0603_CAPC1608X80N]
C409  470nF  [SMD_0603_CAPC1608X80N]
C410  470nF  [SMD_0603_CAPC1608X80N]
C411  470nF  [SMD_0603_CAPC1608X80N]
C412  470nF  [SMD_0603_CAPC1608X80N]
C413  470nF  [SMD_0603_CAPC1608X80N]
C414  470nF  [SMD_0603_CAPC1608X80N]
C415  470nF  [SMD_0603_CAPC1608X80N]
C416  470nF  [SMD_0603_CAPC1608X80N]
C417  470nF  [SMD_0603_CAPC1608X80N]
C418  470nF  [SMD_0603_CAPC1608X80N]
C419  470nF  [SMD_0603_CAPC1608X80N]
C420  470nF  [SMD_0603_CAPC1608X80N]
C421  470nF  [SMD_0603_CAPC1608X80N]
C422  470nF  [SMD_0603_CAPC1608X80N]
C423  470nF  [SMD_0603_CAPC1608X80N]
C424  470nF  [SMD_0603_CAPC1608X80N]
C427  470nF  [SMD_0603_CAPC1608X80N]
C428  470nF  [SMD_0603_CAPC1608X80N]
C429  470nF  [SMD_0603_CAPC1608X80N]
C430  470nF  [SMD_0603_CAPC1608X80N]
C431  470nF  [SMD_0603_CAPC1608X80N]
C432  470nF  [SMD_0603_CAPC1608X80N]
C433  470nF  [SMD_0603_CAPC1608X80N]
C434  470nF  [SMD_0603_CAPC1608X80N]
C435  470nF  [SMD_0603_CAPC1608X80N]
C436  470nF  [SMD_0603_CAPC1608X80N]
C439  470nF  [SMD_0603_CAPC1608X80N]
C440  470nF  [SMD_0603_CAPC1608X80N]
C441  470nF  [SMD_0603_CAPC1608X80N]
C442  470nF  [SMD_0603_CAPC1608X80N]
C443  470nF  [SMD_0603_CAPC1608X80N]
C444  470nF  [SMD_0603_CAPC1608X80N]
C445  470nF  [SMD_0603_CAPC1608X80N]
C446  470nF  [SMD_0603_CAPC1608X80N]
C447  470nF  [SMD_0603_CAPC1608X80N]
C448  470nF  [SMD_0603_CAPC1608X80N]
C449  470nF  [SMD_0603_CAPC1608X80N]
C450  470nF  [SMD_0603_CAPC1608X80N]
C451  470nF  [SMD_0603_CAPC1608X80N]
C452  470nF  [SMD_0603_CAPC1608X80N]
C453  470nF  [SMD_0603_CAPC1608X80N]
C454  470nF  [SMD_0603_CAPC1608X80N]
C455  470nF  [SMD_0603_CAPC1608X80N]
C456  470nF  [SMD_0603_CAPC1608X80N]
C457  470nF  [SMD_0603_CAPC1608X80N]
C458  470nF  [SMD_0603_CAPC1608X80N]
C459  470nF  [SMD_0603_CAPC1608X80N]
C460  470nF  [SMD_0603_CAPC1608X80N]
C461  470nF  [SMD_0603_CAPC1608X80N]
C462  470nF  [SMD_0603_CAPC1608X80N]
C463  470nF  [SMD_0603_CAPC1608X80N]
C464  470nF  [SMD_0603_CAPC1608X80N]
C465  470nF  [SMD_0603_CAPC1608X80N]
C466  470nF  [SMD_0603_CAPC1608X80N]
C467  470nF  [SMD_0603_CAPC1608X80N]
C468  470nF  [SMD_0603_CAPC1608X80N]
C469  470nF  [SMD_0603_CAPC1608X80N]
C470  470nF  [SMD_0603_CAPC1608X80N]
C471  470nF  [SMD_0603_CAPC1608X80N]
C472  470nF  [SMD_0603_CAPC1608X80N]
C475  470nF  [SMD_0603_CAPC1608X80N]
C476  470nF  [SMD_0603_CAPC1608X80N]
C477  470nF  [SMD_0603_CAPC1608X80N]
C478  470nF  [SMD_0603_CAPC1608X80N]
C479  470nF  [SMD_0603_CAPC1608X80N]
C480  470nF  [SMD_0603_CAPC1608X80N]
C481  470nF  [SMD_0603_CAPC1608X80N]
C482  470nF  [SMD_0603_CAPC1608X80N]
C483  470nF  [SMD_0603_CAPC1608X80N]
C489  (OPT)100uF  [SMD_1210_CAPC3225X279N]
C491  (OPT)100uF  [SMD_1210_CAPC3225X279N]
C493  (OPT)100uF  [SMD_1210_CAPC3225X279N]
C494  (OPT)100uF  [SMD_1210_CAPC3225X279N]
C495  (OPT)100uF  [SMD_1210_CAPC3225X279N]
C501  (OPT)100uF  [SMD_1210_CAPC3225X279N]
C503  (OPT)220uF  [SMD_1210_CAPC3225X279N]
C504  (OPT)220uF  [SMD_1210_CAPC3225X279N]
C505  (OPT)220uF  [SMD_1210_CAPC3225X279N]
C506  (OPT)220uF  [SMD_1210_CAPC3225X279N]
C507  (OPT)220uF  [SMD_1210_CAPC3225X279N]
C508  (OPT)220uF  [SMD_1210_CAPC3225X279N]
C509  (OPT)220uF  [SMD_1210_CAPC3225X279N]
C510  (OPT)220uF  [SMD_1210_CAPC3225X279N]
C511  (OPT)220uF  [SMD_1210_CAPC3225X279N]
C512  (OPT)220uF  [SMD_1210_CAPC3225X279N]
C513  (OPT)220uF  [SMD_1210_CAPC3225X279N]
C514  (OPT)220uF  [SMD_1210_CAPC3225X279N]
C515  (OPT)220uF  [SMD_1210_CAPC3225X279N]
C516  (OPT)220uF  [SMD_1210_CAPC3225X279N]
C517  (OPT)220uF  [SMD_1210_CAPC3225X279N]
C518  (OPT)220uF  [SMD_1210_CAPC3225X279N]
C519  (OPT)220uF  [SMD_1210_CAPC3225X279N]
C520  (OPT)220uF  [SMD_1210_CAPC3225X279N]
C521  (OPT)220uF  [SMD_1210_CAPC3225X279N]
C522  (OPT)220uF  [SMD_1210_CAPC3225X279N]
C523  (OPT)220uF  [SMD_1210_CAPC3225X279N]
C524  (OPT)220uF  [SMD_1210_CAPC3225X279N]
C525  (OPT)220uF  [SMD_1210_CAPC3225X279N]
C526  (OPT)220uF  [SMD_1210_CAPC3225X279N]
C527  (OPT)220uF  [SMD_1210_CAPC3225X279N]
C528  (OPT)220uF  [SMD_1210_CAPC3225X279N]
C529  (OPT)220uF  [SMD_1210_CAPC3225X279N]
C530  (OPT)220uF  [SMD_1210_CAPC3225X279N]
C531  (OPT)220uF  [SMD_1210_CAPC3225X279N]
C532  (OPT)220uF  [SMD_1210_CAPC3225X279N]
C533  (OPT)220uF  [SMD_1210_CAPC3225X279N]
C534  (OPT)220uF  [SMD_1210_CAPC3225X279N]
C535  (OPT)220uF  [SMD_1210_CAPC3225X279N]
C536  (OPT)220uF  [SMD_1210_CAPC3225X279N]
D1  BAT54C  [SMD_SOT23_SOT95P240X120-3N]
D2  BAT54C  [SMD_SOT23_SOT95P240X120-3N]
D3  (OPT) BAV56  [SMD_SOT23_SOT95P240X120-3N]
D4  Red SML210VT ROHM  [SMD_0805_LED2012X100N]
D5  Green 	SML210MT ROHM  [SMD_0805_LED2012X100N]
D6  Yellow SML210YT ROHM  [SMD_0805_LED2012X100N]
D7  Orange 	SML210DT ROHM  [SMD_0805_LED2012X100N]
J1  (OPT) CON PROGRAM  [SIP5 PGM TOP]
J2  CON MOLEX HDD  [MOLEX_PWR_4P - AVALON]
J3  CU04SCM15B0-R0  [SMD_CON-CVILUX-CU04-SCM15B0]
J4  CON SIP2  [PTH_HDRV02W64P254_1X02]
J5  CON CAN  [PTH_CON_JST-B2PS-VH]
J6  CON FAN  [PTH_CON_PANCON-MPSS100-04D]
L1  SLC1480-201MLD  [SMD_INDM12501250X800A - Coilcraft SLC1480]
L2  SLC1480-201MLD  [SMD_INDM12501250X800A - Coilcraft SLC1480]
Q1  AP1RA03GMT-3  [SMD_SON127P615X520X100-8N]
Q2  AP1RA03GMT-3  [SMD_SON127P615X520X100-8N]
Q3  AP1RA03GMT-3  [SMD_SON127P615X520X100-8N]
Q4  AP1RA03GMT-3  [SMD_SON127P615X520X100-8N]
Q5  AP1RA03GMT-3  [SMD_SON127P615X520X100-8N]
Q6  AP1RA03GMT-3  [SMD_SON127P615X520X100-8N]
Q7  BSS138  [SMD_SOT23_SOT95P240X120-3N]
Q8  (OPT)BSS138  [SMD_SOT23_SOT95P240X120-3N]
R1  1k  [SMD_0603_RESC1608X55N]
R2  0  [SMD_0603_RESC1608X55N]
R3  2k  [SMD_0603_RESC1608X55N]
R4  2k  [SMD_0603_RESC1608X55N]
R5  2k  [SMD_0603_RESC1608X55N]
R6  2k  [SMD_0603_RESC1608X55N]
R7  (OPT)1k  [SMD_0603_RESC1608X55N]
R8  (OPT)0  [SMD_0603_RESC1608X55N]
R9  10k  [SMD_0603_RESC1608X55N]
R10  (OPT)2k  [SMD_0603_RESC1608X55N]
R11  (OPT)2k  [SMD_0603_RESC1608X55N]
R12  0  [SMD_0603_RESC1608X55N]
R13  (OPT)0  [SMD_0603_RESC1608X55N]
R14  10k  [SMD_0603_RESC1608X55N]
R15  10k  [SMD_0603_RESC1608X55N]
R16  (OPT)0  [SMD_0603_RESC1608X55N]
R17  1k  [SMD_0603_RESC1608X55N]
R18  (OPT)0  [SMD_0603_RESC1608X55N]
R24  1k  [SMD_0603_RESC1608X55N]
R25  1k  [SMD_0603_RESC1608X55N]
R26  1k  [SMD_0603_RESC1608X55N]
R27  1k  [SMD_0603_RESC1608X55N]
R28  1k  [SMD_0603_RESC1608X55N]
R29  1k  [SMD_0603_RESC1608X55N]
R30  1k  [SMD_0603_RESC1608X55N]
R31  1k  [SMD_0603_RESC1608X55N]
R34  27  [SMD_0603_RESC1608X55N]
R35  27  [SMD_0603_RESC1608X55N]
R36  768  [SMD_0603_RESC1608X55N]
R37  2.4k  [SMD_0603_RESC1608X55N]
R38  2.4k  [SMD_0603_RESC1608X55N]
R40  10k  [SMD_0603_RESC1608X55N]
R41  120  [SMD_0603_RESC1608X55N]
R42  (OPT)0  [SMD_0603_RESC1608X55N]
R43  10k  [SMD_0603_RESC1608X55N]
R44  10k  [SMD_0603_RESC1608X55N]
R45  2.4k  [SMD_0603_RESC1608X55N]
R46  0  [SMD_1206_RESC3216X180N]
R47  0  [SMD_1206_RESC3216X180N]
R56  0  [SMD_0603_RESC1608X55N]
R57  10k  [SMD_0603_RESC1608X55N]
R59  10k  [SMD_0603_RESC1608X55N]
R60  0  [SMD_1206_RESC3216X180N]
R61  2.4k  [SMD_0603_RESC1608X55N]
R62  (OPT)0  [SMD_0603_RESC1608X55N]
R63  0  [SMD_0603_RESC1608X55N]
R64  0  [SMD_0603_RESC1608X55N]
R79  1k  [SMD_0603_RESC1608X55N]
R80  1k  [SMD_0603_RESC1608X55N]
R81  1k  [SMD_0603_RESC1608X55N]
R82  1k  [SMD_0603_RESC1608X55N]
R83  1k  [SMD_0603_RESC1608X55N]
R84  1k  [SMD_0603_RESC1608X55N]
R85  1k  [SMD_0603_RESC1608X55N]
R86  1k  [SMD_0603_RESC1608X55N]
R103  1k  [SMD_0603_RESC1608X55N]
R104  1k  [SMD_0603_RESC1608X55N]
R105  1k  [SMD_0603_RESC1608X55N]
R106  1k  [SMD_0603_RESC1608X55N]
R107  1k  [SMD_0603_RESC1608X55N]
R108  1k  [SMD_0603_RESC1608X55N]
R109  1k  [SMD_0603_RESC1608X55N]
R110  1k  [SMD_0603_RESC1608X55N]
R127  1k  [SMD_0603_RESC1608X55N]
R128  1k  [SMD_0603_RESC1608X55N]
R129  1k  [SMD_0603_RESC1608X55N]
R130  1k  [SMD_0603_RESC1608X55N]
R131  1k  [SMD_0603_RESC1608X55N]
R132  1k  [SMD_0603_RESC1608X55N]
R133  1k  [SMD_0603_RESC1608X55N]
R134  1k  [SMD_0603_RESC1608X55N]
U1  dsPIC33EP256MU806  [SMD_QFP50P1200X1200X120-64N]
U2  BITFURY256  [SMD_QFN50P700X700X90-49N]
U3  BITFURY256  [SMD_QFN50P700X700X90-49N]
U4  BITFURY256  [SMD_QFN50P700X700X90-49N]
U5  BITFURY256  [SMD_QFN50P700X700X90-49N]
U6  (OPT)BU33TD3WG-TR  [SMD_SOT26_SOT95P285X140-5N - DLV]
U7  BITFURY256  [SMD_QFN50P700X700X90-49N]
U8  BITFURY256  [SMD_QFN50P700X700X90-49N]
U9  BITFURY256  [SMD_QFN50P700X700X90-49N]
U10  BITFURY256  [SMD_QFN50P700X700X90-49N]
U11  BITFURY256  [SMD_QFN50P700X700X90-49N]
U12  BITFURY256  [SMD_QFN50P700X700X90-49N]
U13  BITFURY256  [SMD_QFN50P700X700X90-49N]
U14  BITFURY256  [SMD_QFN50P700X700X90-49N]
U15  BITFURY256  [SMD_QFN50P700X700X90-49N]
U16  BITFURY256  [SMD_QFN50P700X700X90-49N]
U17  BITFURY256  [SMD_QFN50P700X700X90-49N]
U18  BITFURY256  [SMD_QFN50P700X700X90-49N]
U19  BD33KA5WF  [SMD_SOIC127P602X173-8N]
U20  L78M05CDT-TR  [SMD_TO229P991X239-4AN_DPAK]
U21  MCP2551-I/SN  [SMD_SOIC127P602X173-8N]
U22  (OPT) LM7805  [SMD_SOIC127P602X173-8N]
U23  (OPT) L7805CD2T-TR  [SMD_TO254P1524X483-3_4N_D2PAK + DPAK]
U24  BD18KA5WF  [SMD_SOIC127P602X173-8N]
U25  LTC 4449  [SMD_SOP65P490X110-9N - DUAL]
U30  LTC 4449  [SMD_SOP65P490X110-9N - DUAL]
Y1  Q4.000 MHz HC-49SM SMD  [SMD_HC49_XTAL1140X480X420N]

## Nets
GND: C2.2 C3.2 C4.2 C5.2 C6.2 C7.2 C8.2 C9.2 C11.2 C12.2 C13.1 C14.1 C15.1 C16.1 C17.2 C18.1 C19.1 C20.1 C21.1 C22.1 C23.1 C24.1 C25.1 C26.1 C27.1 C28.1 C29.1 C30.2 C32.2 C33.2 C34.2 C35.2 C36.2 C37.2 C39.2 C40.2 C41.2 C42.2 C43.2 C44.2 C46.2 C48.2 C49.2 C50.2 C51.2 C52.2 C53.2 C54.2 C55.2 C56.2 C57.2 C58.2 C60.2 C61.2 C62.2 C63.2 C64.2 C66.2 C67.2 C68.2 C69.2 C70.2 C71.2 C72.2 C73.2 C74.2 C75.2 C76.2 C77.2 C78.2 C79.2 C80.2 C81.2 C82.2 C83.2 C84.2 C85.2 C86.2 C87.2 C88.2 C89.2 C90.2 C91.2 C92.2 C93.2 C94.2 C95.2 C96.2 C97.2 C98.2 C100.2 C102.2 C103.2 C105.2 C106.2 C107.2 C108.2 C109.2 C110.2 C111.2 C112.2 C113.2 C114.2 C115.2 C116.2 C117.2 C118.2 C119.2 C120.2 C121.2 C122.2 C123.2 C124.2 C125.2 C126.2 C127.2 C128.2 C129.2 C130.2 C131.2 C132.2 C133.2 C134.2 C135.2 C136.2 C137.2 C138.2 C139.2 C140.2 C142.2 C144.2 C145.2 C146.2 C148.2 C149.2 C150.2 C152.2 C153.2 C154.2 C155.2 C156.2 C157.2 C158.2 C159.2 C160.2 C161.2 C162.2 C163.2 C164.2 C165.2 C166.2 C167.2 C169.2 C170.2 C171.2 C172.2 C173.2 C174.2 C175.2 C176.2 C177.2 C178.2 C179.2 C180.2 C181.2 C182.2 C183.2 C184.2 C185.2 C187.2 C188.1 C190.2 C191.2 C192.2 C193.2 C195.2 C196.2 C197.2 C198.2 C199.2 C200.2 C201.2 C202.2 C203.2 C204.2 C205.2 C206.1 C207.2 C208.2 C210.2 C211.2 C213.2 C214.2 C215.2 C216.2 C217.2 C218.2 C219.2 C220.2 C221.2 C222.2 C223.2 C224.2 C225.2 C226.2 C227.2 C228.2 C229.2 C231.2 C233.2 C234.2 C237.2 C238.2 C239.2 C240.2 C241.2 C242.2 C243.2 C244.2 C245.2 C246.2 C247.2 C248.2 C249.2 C250.2 C251.2 C252.2 C253.1 C254.1 C255.2 C256.2 C257.2 C258.2 C259.2 C260.2 C261.2 C262.2 C263.2 C264.2 C265.2 C266.2 C267.2 C268.2 C269.2 C270.2 C271.2 C272.2 C273.2 C274.2 C275.2 C276.2 C277.2 C278.2 C279.2 C280.2 C281.2 C282.2 C283.2 C284.2 C285.2 C286.2 C287.2 C288.2 C289.2 C290.2 C291.2 C292.2 C293.2 C294.2 C295.2 C296.2 C297.2 C298.2 C299.2 C300.2 C301.2 C302.2 C303.2 C304.2 C305.2 C306.2 C307.2 C308.1 C309.2 C311.2 C313.2 C314.2 C315.2 C316.2 C317.2 C318.2 C319.2 C320.2 C321.2 C322.2 C323.2 C324.2 C325.2 C326.2 C327.2 C328.2 C329.2 C330.2 C331.2 C332.2 C333.2 C334.2 C335.2 C336.2 C337.2 C338.2 C339.2 C340.2 C341.2 C342.2 C343.2 C344.2 C345.2 C346.2 C347.2 C348.2 C349.2 C351.2 C352.2 C353.2 C355.2 C356.2 C358.2 C359.2 C360.2 C361.2 C362.2 C363.2 C364.2 C365.2 C366.2 C367.2 C368.2 C369.2 C370.2 C371.2 C372.2 C373.2 C374.2 C375.2 C376.2 C377.2 C378.2 C379.2 C380.2 C381.2 C382.2 C383.2 C384.2 C385.2 C386.2 C387.2 C388.1 C389.1 C390.1 C391.1 C392.1 C393.1 C394.1 C395.1 C396.1 C397.1 C398.1 C399.1 C400.1 C401.1 C402.1 C403.1 C404.1 C405.1 C406.1 C407.1 C408.1 C409.1 C410.1 C411.1 C412.1 C413.1 C414.1 C415.1 C416.1 C417.1 C418.1 C419.1 C420.1 C421.1 C422.1 C423.1 C424.1 C427.1 C428.1 C429.1 C430.1 C431.1 C432.1 C433.1 C434.1 C435.1 C436.1 C439.1 C440.1 C441.1 C442.1 C443.1 C444.1 C445.1 C446.1 C447.1 C448.1 C449.1 C450.1 C451.1 C452.1 C453.1 C454.1 C455.1 C456.1 C457.1 C458.1 C459.1 C460.1 C461.1 C462.1 C463.1 C464.1 C465.1 C466.1 C467.1 C468.1 C469.1 C470.1 C471.1 C472.1 C475.1 C476.1 C477.1 C478.1 C479.1 C480.1 C481.1 C482.1 C483.1 C489.2 C491.2 C493.2 C494.2 C495.2 C501.2 C503.2 C504.2 C505.2 C506.2 C507.2 C508.2 C509.2 C510.2 C511.2 C512.2 C513.2 C514.2 C515.2 C516.2 C517.2 C518.2 C519.2 C520.2 C521.2 C522.2 C523.2 C524.2 C525.2 C526.2 C527.2 C528.2 C529.2 C530.2 C531.2 C532.2 C533.2 C534.2 C535.2 C536.2 D3.1(A1) D3.2(A2) D4.1(C) D5.1(C) D6.1(C) D7.1(C) J1.3 J2.2 J2.3 J3.5 J3.6 J3.7 J3.8 J3.9 J6.1 Q2.1(S) Q2.2(S) Q2.3(S) Q3.1(S) Q3.2(S) Q3.3(S) Q5.1(S) Q5.2(S) Q5.3(S) Q6.1(S) Q6.2(S) Q6.3(S) Q7.2(E) Q8.2(E) R4.1 R6.1 R14.1 R15.1 R17.2 R24.1 R25.1 R26.1 R27.1 R40.1 R45.1 R59.1 R60.1 R61.1 R79.1 R80.1 R81.1 R82.1 R103.1 R104.1 R105.1 R106.1 R127.1 R128.1 R129.1 R130.1 U1.9(VSS) U1.20(AVSS) U1.25(VSS) U1.41(VSS) U2.1(CQM) U2.2(CMPLUS) U2.3(CMMINUS) U2.12(INCLK) U2.49(EP) U3.1(CQM) U3.2(CMPLUS) U3.3(CMMINUS) U3.12(INCLK) U3.49(EP) U4.1(CQM) U4.2(CMPLUS) U4.3(CMMINUS) U4.12(INCLK) U4.49(EP) U5.1(CQM) U5.2(CMPLUS) U5.3(CMMINUS) U5.12(INCLK) U5.49(EP) U6.2(GND) U7.1(CQM) U7.2(CMPLUS) U7.3(CMMINUS) U7.12(INCLK) U7.49(EP) U8.1(CQM) U8.2(CMPLUS) U8.3(CMMINUS) U8.12(INCLK) U8.49(EP) U9.1(CQM) U9.2(CMPLUS) U9.3(CMMINUS) U9.12(INCLK) U9.49(EP) U10.1(CQM) U10.2(CMPLUS) U10.3(CMMINUS) U10.12(INCLK) U10.49(EP) U11.1(CQM) U11.2(CMPLUS) U11.3(CMMINUS) U11.12(INCLK) U11.49(EP) U12.1(CQM) U12.2(CMPLUS) U12.3(CMMINUS) U12.12(INCLK) U12.49(EP) U13.1(CQM) U13.2(CMPLUS) U13.3(CMMINUS) U13.12(INCLK) U13.49(EP) U14.1(CQM) U14.2(CMPLUS) U14.3(CMMINUS) U14.12(INCLK) U14.49(EP) U15.1(CQM) U15.2(CMPLUS) U15.3(CMMINUS) U15.12(INCLK) U15.49(EP) U16.1(CQM) U16.2(CMPLUS) U16.3(CMMINUS) U16.12(INCLK) U16.49(EP) U17.1(CQM) U17.2(CMPLUS) U17.3(CMMINUS) U17.12(INCLK) U17.49(EP) U18.1(CQM) U18.2(CMPLUS) U18.3(CMMINUS) U18.12(INCLK) U18.49(EP) U19.6(GND) U19.7(GND) U21.3(Vdd) U21.8(Rs) U24.6(GND) U24.7(GND) U25.4(GND) U25.9(EP) U30.4(GND) U30.9(EP)
0.8V: C2.1 C3.1 C4.1 C5.1 C6.1 C7.1 C8.1 C9.1 C11.1 C12.1 C30.1 C32.1 C33.1 C35.1 C36.1 C37.1 C39.1 C40.1 C41.1 C42.1 C43.1 C44.1 C46.1 C48.1 C49.1 C50.1 C51.1 C52.1 C53.1 C54.1 C55.1 C56.1 C57.1 C58.1 C60.1 C61.1 C62.1 C64.1 C66.1 C67.1 C68.1 C69.1 C70.1 C71.1 C77.1 C78.1 C79.1 C80.1 C81.1 C82.1 C83.1 C84.1 C87.1 C88.1 C89.1 C90.1 C91.1 C92.1 C93.1 C94.1 C95.1 C96.1 C97.1 C98.1 C100.1 C102.1 C103.1 C105.1 C106.1 C107.1 C108.1 C109.1 C110.1 C111.1 C112.1 C113.1 C114.1 C115.1 C116.1 C117.1 C118.1 C119.1 C120.1 C121.1 C122.1 C123.1 C124.1 C125.1 C126.1 C127.1 C128.1 C129.1 C130.1 C131.1 C132.1 C133.1 C134.1 C135.1 C136.1 C137.1 C138.1 C139.1 C140.1 C142.1 C144.1 C145.1 C146.1 C148.1 C149.1 C150.1 C152.1 C153.1 C154.1 C155.1 C156.1 C157.1 C158.1 C159.1 C160.1 C161.1 C162.1 C163.1 C164.1 C165.1 C166.1 C167.1 C169.1 C170.1 C171.1 C172.1 C173.1 C174.1 C175.1 C176.1 C177.1 C178.1 C179.1 C180.1 C181.1 C182.1 C183.1 C184.1 C185.1 C198.1 C199.1 C200.1 C201.1 C202.1 C203.1 C204.1 C205.1 C209.2 C220.1 C221.1 C222.1 C223.1 C224.1 C225.1 C226.1 C227.1 C228.1 C238.1 C239.1 C240.1 C241.1 C242.1 C243.1 C244.1 C245.1 C246.1 C247.1 C256.1 C257.1 C258.1 C259.1 C260.1 C261.1 C262.1 C271.1 C282.1 C283.1 C284.1 C285.1 C286.1 C287.1 C288.1 C289.1 C290.1 C291.1 C292.1 C293.1 C294.1 C295.1 C296.1 C297.1 C298.1 C299.1 C300.1 C301.1 C302.1 C303.1 C304.1 C305.1 C306.1 C307.1 C309.1 C313.1 C314.1 C315.1 C316.1 C317.1 C318.1 C319.1 C320.1 C321.1 C322.1 C323.1 C324.1 C326.1 C327.1 C328.1 C329.1 C330.1 C331.1 C332.1 C333.1 C334.1 C335.1 C336.1 C337.1 C338.1 C339.1 C340.1 C341.1 C342.1 C343.1 C344.1 C345.1 C346.1 C347.1 C348.1 C349.1 C351.1 C352.1 C353.1 C355.1 C356.1 C358.1 C359.1 C360.1 C361.1 C362.1 C363.1 C364.1 C365.1 C366.1 C367.1 C368.1 C369.1 C370.1 C371.1 C372.1 C373.1 C374.1 C375.1 C376.1 C377.1 C378.1 C379.1 C380.1 C381.1 C382.1 C383.1 C384.1 C385.1 C386.1 C387.1 C388.2 C389.2 C390.2 C391.2 C392.2 C393.2 C394.2 C395.2 C396.2 C397.2 C398.2 C399.2 C400.2 C401.2 C402.2 C403.2 C404.2 C405.2 C406.2 C407.2 C408.2 C409.2 C410.2 C411.2 C412.2 C413.2 C414.2 C415.2 C416.2 C417.2 C418.2 C419.2 C420.2 C421.2 C422.2 C423.2 C424.2 C427.2 C428.2 C429.2 C430.2 C431.2 C432.2 C433.2 C434.2 C435.2 C436.2 C439.2 C440.2 C441.2 C442.2 C443.2 C444.2 C445.2 C446.2 C447.2 C448.2 C449.2 C450.2 C451.2 C452.2 C453.2 C454.2 C455.2 C456.2 C457.2 C458.2 C459.2 C460.2 C461.2 C462.2 C463.2 C464.2 C465.2 C466.2 C467.2 C468.2 C469.2 C470.2 C471.2 C472.2 C475.2 C476.2 C477.2 C478.2 C479.2 C480.2 C481.2 C482.2 C483.2 C503.1 C504.1 C505.1 C506.1 C507.1 C508.1 C509.1 C510.1 C511.1 C512.1 C513.1 C514.1 C515.1 C516.1 C517.1 C518.1 C519.1 C520.1 C521.1 C522.1 C523.1 C524.1 C525.1 C526.1 C527.1 C528.1 C529.1 C530.1 C531.1 C532.1 C533.1 C534.1 C535.1 C536.1 L1.2 L2.2 R38.2 R43.2 U2.14(VDD) U2.15(VDD) U2.16(VDD) U2.17(VDD) U2.18(VDD) U2.19(VDD) U2.20(VDD) U2.21(VDD) U2.22(VDD) U2.23(VDD) U2.24(VDD) U2.25(VDD) U2.26(VDD) U2.27(VDD) U2.28(VDD) U2.29(VDD) U2.30(VDD) U2.31(VDD) U2.32(VDD) U2.33(VDD) U2.34(VDD) U2.35(VDD) U2.36(VDD) U2.37(VDD) U2.38(VDD) U2.39(VDD) U2.40(VDD) U2.41(VDD) U2.42(VDD) U2.43(VDD) U2.44(VDD) U2.45(VDD) U2.46(VDD) U2.47(VDD) U2.48(VDD) U3.14(VDD) U3.15(VDD) U3.16(VDD) U3.17(VDD) U3.18(VDD) U3.19(VDD) U3.20(VDD) U3.21(VDD) U3.22(VDD) U3.23(VDD) U3.24(VDD) U3.25(VDD) U3.26(VDD) U3.27(VDD) U3.28(VDD) U3.29(VDD) U3.30(VDD) U3.31(VDD) U3.32(VDD) U3.33(VDD) U3.34(VDD) U3.35(VDD) U3.36(VDD) U3.37(VDD) U3.38(VDD) U3.39(VDD) U3.40(VDD) U3.41(VDD) U3.42(VDD) U3.43(VDD) U3.44(VDD) U3.45(VDD) U3.46(VDD) U3.47(VDD) U3.48(VDD) U4.14(VDD) U4.15(VDD) U4.16(VDD) U4.17(VDD) U4.18(VDD) U4.19(VDD) U4.20(VDD) U4.21(VDD) U4.22(VDD) U4.23(VDD) U4.24(VDD) U4.25(VDD) U4.26(VDD) U4.27(VDD) U4.28(VDD) U4.29(VDD) U4.30(VDD) U4.31(VDD) U4.32(VDD) U4.33(VDD) U4.34(VDD) U4.35(VDD) U4.36(VDD) U4.37(VDD) U4.38(VDD) U4.39(VDD) U4.40(VDD) U4.41(VDD) U4.42(VDD) U4.43(VDD) U4.44(VDD) U4.45(VDD) U4.46(VDD) U4.47(VDD) U4.48(VDD) U5.14(VDD) U5.15(VDD) U5.16(VDD) U5.17(VDD) U5.18(VDD) U5.19(VDD) U5.20(VDD) U5.21(VDD) U5.22(VDD) U5.23(VDD) U5.24(VDD) U5.25(VDD) U5.26(VDD) U5.27(VDD) U5.28(VDD) U5.29(VDD) U5.30(VDD) U5.31(VDD) U5.32(VDD) U5.33(VDD) U5.34(VDD) U5.35(VDD) U5.36(VDD) U5.37(VDD) U5.38(VDD) U5.39(VDD) U5.40(VDD) U5.41(VDD) U5.42(VDD) U5.43(VDD) U5.44(VDD) U5.45(VDD) U5.46(VDD) U5.47(VDD) U5.48(VDD) U7.14(VDD) U7.15(VDD) U7.16(VDD) U7.17(VDD) U7.18(VDD) U7.19(VDD) U7.20(VDD) U7.21(VDD) U7.22(VDD) U7.23(VDD) U7.24(VDD) U7.25(VDD) U7.26(VDD) U7.27(VDD) U7.28(VDD) U7.29(VDD) U7.30(VDD) U7.31(VDD) U7.32(VDD) U7.33(VDD) U7.34(VDD) U7.35(VDD) U7.36(VDD) U7.37(VDD) U7.38(VDD) U7.39(VDD) U7.40(VDD) U7.41(VDD) U7.42(VDD) U7.43(VDD) U7.44(VDD) U7.45(VDD) U7.46(VDD) U7.47(VDD) U7.48(VDD) U8.14(VDD) U8.15(VDD) U8.16(VDD) U8.17(VDD) U8.18(VDD) U8.19(VDD) U8.20(VDD) U8.21(VDD) U8.22(VDD) U8.23(VDD) U8.24(VDD) U8.25(VDD) U8.26(VDD) U8.27(VDD) U8.28(VDD) U8.29(VDD) U8.30(VDD) U8.31(VDD) U8.32(VDD) U8.33(VDD) U8.34(VDD) U8.35(VDD) U8.36(VDD) U8.37(VDD) U8.38(VDD) U8.39(VDD) U8.40(VDD) U8.41(VDD) U8.42(VDD) U8.43(VDD) U8.44(VDD) U8.45(VDD) U8.46(VDD) U8.47(VDD) U8.48(VDD) U9.14(VDD) U9.15(VDD) U9.16(VDD) U9.17(VDD) U9.18(VDD) U9.19(VDD) U9.20(VDD) U9.21(VDD) U9.22(VDD) U9.23(VDD) U9.24(VDD) U9.25(VDD) U9.26(VDD) U9.27(VDD) U9.28(VDD) U9.29(VDD) U9.30(VDD) U9.31(VDD) U9.32(VDD) U9.33(VDD) U9.34(VDD) U9.35(VDD) U9.36(VDD) U9.37(VDD) U9.38(VDD) U9.39(VDD) U9.40(VDD) U9.41(VDD) U9.42(VDD) U9.43(VDD) U9.44(VDD) U9.45(VDD) U9.46(VDD) U9.47(VDD) U9.48(VDD) U10.14(VDD) U10.15(VDD) U10.16(VDD) U10.17(VDD) U10.18(VDD) U10.19(VDD) U10.20(VDD) U10.21(VDD) U10.22(VDD) U10.23(VDD) U10.24(VDD) U10.25(VDD) U10.26(VDD) U10.27(VDD) U10.28(VDD) U10.29(VDD) U10.30(VDD) U10.31(VDD) U10.32(VDD) U10.33(VDD) U10.34(VDD) U10.35(VDD) U10.36(VDD) U10.37(VDD) U10.38(VDD) U10.39(VDD) U10.40(VDD) U10.41(VDD) U10.42(VDD) U10.43(VDD) U10.44(VDD) U10.45(VDD) U10.46(VDD) U10.47(VDD) U10.48(VDD) U11.14(VDD) U11.15(VDD) U11.16(VDD) U11.17(VDD) U11.18(VDD) U11.19(VDD) U11.20(VDD) U11.21(VDD) U11.22(VDD) U11.23(VDD) U11.24(VDD) U11.25(VDD) U11.26(VDD) U11.27(VDD) U11.28(VDD) U11.29(VDD) U11.30(VDD) U11.31(VDD) U11.32(VDD) U11.33(VDD) U11.34(VDD) U11.35(VDD) U11.36(VDD) U11.37(VDD) U11.38(VDD) U11.39(VDD) U11.40(VDD) U11.41(VDD) U11.42(VDD) U11.43(VDD) U11.44(VDD) U11.45(VDD) U11.46(VDD) U11.47(VDD) U11.48(VDD) U12.14(VDD) U12.15(VDD) U12.16(VDD) U12.17(VDD) U12.18(VDD) U12.19(VDD) U12.20(VDD) U12.21(VDD) U12.22(VDD) U12.23(VDD) U12.24(VDD) U12.25(VDD) U12.26(VDD) U12.27(VDD) U12.28(VDD) U12.29(VDD) U12.30(VDD) U12.31(VDD) U12.32(VDD) U12.33(VDD) U12.34(VDD) U12.35(VDD) U12.36(VDD) U12.37(VDD) U12.38(VDD) U12.39(VDD) U12.40(VDD) U12.41(VDD) U12.42(VDD) U12.43(VDD) U12.44(VDD) U12.45(VDD) U12.46(VDD) U12.47(VDD) U12.48(VDD) U13.14(VDD) U13.15(VDD) U13.16(VDD) U13.17(VDD) U13.18(VDD) U13.19(VDD) U13.20(VDD) U13.21(VDD) U13.22(VDD) U13.23(VDD) U13.24(VDD) U13.25(VDD) U13.26(VDD) U13.27(VDD) U13.28(VDD) U13.29(VDD) U13.30(VDD) U13.31(VDD) U13.32(VDD) U13.33(VDD) U13.34(VDD) U13.35(VDD) U13.36(VDD) U13.37(VDD) U13.38(VDD) U13.39(VDD) U13.40(VDD) U13.41(VDD) U13.42(VDD) U13.43(VDD) U13.44(VDD) U13.45(VDD) U13.46(VDD) U13.47(VDD) U13.48(VDD) U14.14(VDD) U14.15(VDD) U14.16(VDD) U14.17(VDD) U14.18(VDD) U14.19(VDD) U14.20(VDD) U14.21(VDD) U14.22(VDD) U14.23(VDD) U14.24(VDD) U14.25(VDD) U14.26(VDD) U14.27(VDD) U14.28(VDD) U14.29(VDD) U14.30(VDD) U14.31(VDD) U14.32(VDD) U14.33(VDD) U14.34(VDD) U14.35(VDD) U14.36(VDD) U14.37(VDD) U14.38(VDD) U14.39(VDD) U14.40(VDD) U14.41(VDD) U14.42(VDD) U14.43(VDD) U14.44(VDD) U14.45(VDD) U14.46(VDD) U14.47(VDD) U14.48(VDD) U15.14(VDD) U15.15(VDD) U15.16(VDD) U15.17(VDD) U15.18(VDD) U15.19(VDD) U15.20(VDD) U15.21(VDD) U15.22(VDD) U15.23(VDD) U15.24(VDD) U15.25(VDD) U15.26(VDD) U15.27(VDD) U15.28(VDD) U15.29(VDD) U15.30(VDD) U15.31(VDD) U15.32(VDD) U15.33(VDD) U15.34(VDD) U15.35(VDD) U15.36(VDD) U15.37(VDD) U15.38(VDD) U15.39(VDD) U15.40(VDD) U15.41(VDD) U15.42(VDD) U15.43(VDD) U15.44(VDD) U15.45(VDD) U15.46(VDD) U15.47(VDD) U15.48(VDD) U16.14(VDD) U16.15(VDD) U16.16(VDD) U16.17(VDD) U16.18(VDD) U16.19(VDD) U16.20(VDD) U16.21(VDD) U16.22(VDD) U16.23(VDD) U16.24(VDD) U16.25(VDD) U16.26(VDD) U16.27(VDD) U16.28(VDD) U16.29(VDD) U16.30(VDD) U16.31(VDD) U16.32(VDD) U16.33(VDD) U16.34(VDD) U16.35(VDD) U16.36(VDD) U16.37(VDD) U16.38(VDD) U16.39(VDD) U16.40(VDD) U16.41(VDD) U16.42(VDD) U16.43(VDD) U16.44(VDD) U16.45(VDD) U16.46(VDD) U16.47(VDD) U16.48(VDD) U17.14(VDD) U17.15(VDD) U17.16(VDD) U17.17(VDD) U17.18(VDD) U17.19(VDD) U17.20(VDD) U17.21(VDD) U17.22(VDD) U17.23(VDD) U17.24(VDD) U17.25(VDD) U17.26(VDD) U17.27(VDD) U17.28(VDD) U17.29(VDD) U17.30(VDD) U17.31(VDD) U17.32(VDD) U17.33(VDD) U17.34(VDD) U17.35(VDD) U17.36(VDD) U17.37(VDD) U17.38(VDD) U17.39(VDD) U17.40(VDD) U17.41(VDD) U17.42(VDD) U17.43(VDD) U17.44(VDD) U17.45(VDD) U17.46(VDD) U17.47(VDD) U17.48(VDD) U18.14(VDD) U18.15(VDD) U18.16(VDD) U18.17(VDD) U18.18(VDD) U18.19(VDD) U18.20(VDD) U18.21(VDD) U18.22(VDD) U18.23(VDD) U18.24(VDD) U18.25(VDD) U18.26(VDD) U18.27(VDD) U18.28(VDD) U18.29(VDD) U18.30(VDD) U18.31(VDD) U18.32(VDD) U18.33(VDD) U18.34(VDD) U18.35(VDD) U18.36(VDD) U18.37(VDD) U18.38(VDD) U18.39(VDD) U18.40(VDD) U18.41(VDD) U18.42(VDD) U18.43(VDD) U18.44(VDD) U18.45(VDD) U18.46(VDD) U18.47(VDD) U18.48(VDD)
0.8VR1: C13.2 R24.2 R28.1 U2.13(IOREF)
0.8VR2: C14.2 R25.2 R29.1 U3.13(IOREF)
0.8VR3: C15.2 R26.2 R30.1 U4.13(IOREF)
0.8VR4: C16.2 R27.2 R31.1 U5.13(IOREF)
0.8VR5: C18.2 R79.2 R83.1 U7.13(IOREF)
0.8VR6: C19.2 R80.2 R84.1 U8.13(IOREF)
0.8VR7: C20.2 R81.2 R85.1 U9.13(IOREF)
0.8VR8: C21.2 R82.2 R86.1 U10.13(IOREF)
0.8VR9: C22.2 R103.2 R107.1 U11.13(IOREF)
0.8VR10: C23.2 R104.2 R108.1 U12.13(IOREF)
0.8VR11: C24.2 R105.2 R109.1 U13.13(IOREF)
0.8VR12: C25.2 R106.2 R110.1 U14.13(IOREF)
0.8VR13: C26.2 R127.2 R131.1 U15.13(IOREF)
0.8VR14: C27.2 R128.2 R132.1 U16.13(IOREF)
0.8VR15: C28.2 R129.2 R133.1 U17.13(IOREF)
0.8VR16: C29.2 R130.2 R134.1 U18.13(IOREF)
1.8V: C206.2 R28.2 R29.2 R30.2 R31.2 R83.2 R84.2 R85.2 R86.2 R107.2 R108.2 R109.2 R110.2 R131.2 R132.2 R133.2 R134.2 U2.4(VDD_IO) U3.4(VDD_IO) U4.4(VDD_IO) U5.4(VDD_IO) U7.4(VDD_IO) U8.4(VDD_IO) U9.4(VDD_IO) U10.4(VDD_IO) U11.4(VDD_IO) U12.4(VDD_IO) U13.4(VDD_IO) U14.4(VDD_IO) U15.4(VDD_IO) U16.4(VDD_IO) U17.4(VDD_IO) U18.4(VDD_IO) U24.1(OUTPUT)
3.3V: C34.1 C63.1 C73.1 C74.1 C75.1 C76.1 C211.1 C229.1 C233.1 C234.1 C237.1 C248.1 C249.1 C250.1 J1.2 R1.2 R7.1 R9.2 R12.1 R16.1 R18.1 U1.10(VDD) U1.19(AVDD) U1.26(VDD) U1.35(VUSB3V3) U1.38(VDD) U1.57(VDD) U6.5(Vout) U19.1(OUTPUT)
5.0V: C188.2 C231.1 C308.2 D1.1(A1) D1.2(A2) D2.1(A1) D2.2(A2) R42.1 R63.1 U20.3(Vin) U22.1(OUTPUT) U23.3(Vin) U25.7(VCC) U30.7(VCC)
5.0V PS: J2.4 R42.2
12V: C190.1 C191.1 C192.1 C193.1 C195.1 C196.1 C197.1 C207.1 C208.1 C210.1 C213.1 C214.1 C215.1 C216.1 C217.1 C218.1 C219.1 C263.1 C264.1 C265.1 C266.1 C267.1 C268.1 C269.1 C270.1 C272.1 C273.1 C274.1 C275.1 C276.1 C277.1 C278.1 C279.1 C280.1 C281.1 C489.1 C491.1 C493.1 C494.1 C495.1 C501.1 J2.1 J6.2 Q1.5(D) Q1.6(D) Q1.7(D) Q1.8(D) Q4.5(D) Q4.6(D) Q4.7(D) Q4.8(D) R57.1 U20.1(Vout) U22.8(INPUT) U23.1(Vout)
BOOT3: C312.1 D2.3(CC) U30.8(BOOT)
BOOT4: C189.1 D1.3(CC) U25.8(BOOT)
C1Rx: U1.58(VCMPST1/RP96/RF0) U21.4(Rx)
C1Tx: U1.59(VCMPST2/RP97/RF1) U21.1(Tx)
CAN5.0V: C255.1 R47.1 R64.1 U21.2(GND)
CANH: J4.1 J5.2 U21.7(CANH)
CANL: J5.1 R41.2 U21.6(CANL)
CLK0: U2.5(OUTCLK)
CLK1: U3.5(OUTCLK)
CLK2: U4.5(OUTCLK)
CLK3: U5.5(OUTCLK)
CLK4: U7.5(OUTCLK)
CLK5: U8.5(OUTCLK)
CLK6: U9.5(OUTCLK)
CLK7: U10.5(OUTCLK)
CLK8: U11.5(OUTCLK)
CLK9: U12.5(OUTCLK)
CLK10: U13.5(OUTCLK)
CLK11: U14.5(OUTCLK)
CLK12: U15.5(OUTCLK)
CLK13: U16.5(OUTCLK)
CLK14: U17.5(OUTCLK)
CLK15: U18.5(OUTCLK)
CONFIG_N1: U1.42(RTCC/DMLN/RPI72/RD8)
CONFIG_P1: U1.43(ASDA1/DPLN/RPI73/RD9)
CSN4: R38.1 U1.14(AN2/C2IN2-/VMIO/RPI34/RB2)
CSP4: R37.1 U1.13(AN3/C2IN1+/VPIO/RPI35/RB3)
D+: C254.2 R35.2 U1.37(D+/RG2)
D-: C253.2 R34.2 U1.36(D-/RG3)
FAN5.0V: R63.2 R64.2
FB: C251.1 R43.1 U1.17(PGEC1/AN6/RPI38/RB6)
GREEN: D5.2(A) U1.62(AN26/PWM2L/PMD2/RP82/RE2)
HO3: Q4.4(G) U30.1(HO)
HO4: Q1.4(G) U25.1(HO)
LDO3.3V-5.0V: R12.2 R13.1 U24.5(N.C.) U24.8(INPUT)
LDO5.0V: C187.1 R13.2 R46.1 R47.2 R62.2 U6.1(Vin) U6.3(STBY) U19.5(N.C.) U19.8(INPUT)
LMGND: D3.3(CC) R60.2 U20.2(GND) U22.2(GND) U22.3(GND) U22.4(N.C.) U22.5(N.C.) U22.6(GND) U22.7(GND) U23.2(GND)
LO3: Q5.4(G) Q6.4(G) U30.3(LO)
LO4: Q2.4(G) Q3.4(G) U25.3(LO)
Main OSC In: C85.1 U1.39(OSC1/RPI60/RC12) Y1.1
Main OSC Out: C86.1 U1.40(OSC2/CLKO/RC15) Y1.2
MCLR: C72.1 J1.1 R9.1 U1.7(MCLR)
MCU_MISO0: Q7.3(C) R1.1 U1.5(C1IN1-/SDI2/PMA4/RPI119/RG7)
MCU_MISO1: Q8.3(C) R7.2 U1.50(DPH/RP66/RD2)
MCU_MOSI0: R3.2 U1.6(C2IN3-/SDO2/PMA3/RP120/RG8)
MCU_MOSI1: R10.2 U1.49(VCPCON/RP65/RD1)
MCU_SCK0: R5.2 U1.4(C1IN3-/SCK2/PMA5/RP118/RG6)
MCU_SCK1: R11.2 U1.51(PMBE/RP67/RD3)
MEAS12: C325.1 R57.2 R61.2 U1.18(PGED1/AN7/RCV/RPI39/RB7)
ORANGE: D7.2(A) U1.45(PMCS1/RPI75/RD11)
PGC: J1.5 U1.15(PGEC3/AN1/VREF-/RPI33/RB1)
PGD: J1.4 U1.16(PGED3/AN0/VREF+/RPI32/RB0)
PWM: J6.4 U1.61(AN25/PWM1H/PMD1/RPI81/RE1)
PWM3H: R59.2 U1.1(AN29/PWM3H/PMD5/RP85/RE5) U30.5(IN)
PWM3L: C311.1 R14.2 R18.2 U1.64(AN28/PWM3L/PMD4/RP84/RE4) U30.6(Vlogic)
PWM4H: R40.2 U1.3(AN31/PWM4H/PMD7/RP87/RE7) U25.5(IN)
PWM4L: C252.1 R15.2 R16.2 U1.2(AN30/PWM4L/PMD6/RPI86/RE6) U25.6(Vlogic)
RED: D4.2(A) U1.63(AN27/PWM2H/PMD3/RPI83/RE3)
RPM: R44.1 R45.2 U1.60(AN24/PWM1L/PMD0/RP80/RE0)
RPMF: J6.3 R44.2
SPI_MISO0: R2.1 R8.1 U2.9(INMISO)
SPI_MISO1: U2.8(OUTMISO) U3.9(INMISO)
SPI_MISO2: U3.8(OUTMISO) U4.9(INMISO)
SPI_MISO3: U4.8(OUTMISO) U5.9(INMISO)
SPI_MISO4: U5.8(OUTMISO) U7.9(INMISO)
SPI_MISO5: U7.8(OUTMISO) U8.9(INMISO)
SPI_MISO6: U8.8(OUTMISO) U9.9(INMISO)
SPI_MISO7: U9.8(OUTMISO) U10.9(INMISO)
SPI_MISO8: U10.8(OUTMISO) U11.9(INMISO)
SPI_MISO9: U11.8(OUTMISO) U12.9(INMISO)
SPI_MISO10: U12.8(OUTMISO) U13.9(INMISO)
SPI_MISO11: U13.8(OUTMISO) U14.9(INMISO)
SPI_MISO12: U14.8(OUTMISO) U15.9(INMISO)
SPI_MISO13: U15.8(OUTMISO) U16.9(INMISO)
SPI_MISO14: U16.8(OUTMISO) U17.9(INMISO)
SPI_MISO15: U17.8(OUTMISO) U18.9(INMISO)
SPI_MISO16: U18.8(OUTMISO)
SPI_MOSI0: R3.1 R4.2 R10.1 U2.10(INMOSI)
SPI_MOSI1: U2.7(OUTMOSI) U3.10(INMOSI)
SPI_MOSI2: U3.7(OUTMOSI) U4.10(INMOSI)
SPI_MOSI3: U4.7(OUTMOSI) U5.10(INMOSI)
SPI_MOSI4: U5.7(OUTMOSI) U7.10(INMOSI)
SPI_MOSI5: U7.7(OUTMOSI) U8.10(INMOSI)
SPI_MOSI6: U8.7(OUTMOSI) U9.10(INMOSI)
SPI_MOSI7: U9.7(OUTMOSI) U10.10(INMOSI)
SPI_MOSI8: U10.7(OUTMOSI) U11.10(INMOSI)
SPI_MOSI9: U11.7(OUTMOSI) U12.10(INMOSI)
SPI_MOSI10: U12.7(OUTMOSI) U13.10(INMOSI)
SPI_MOSI11: U13.7(OUTMOSI) U14.10(INMOSI)
SPI_MOSI12: U14.7(OUTMOSI) U15.10(INMOSI)
SPI_MOSI13: U15.7(OUTMOSI) U16.10(INMOSI)
SPI_MOSI14: U16.7(OUTMOSI) U17.10(INMOSI)
SPI_MOSI15: U17.7(OUTMOSI) U18.10(INMOSI)
SPI_MOSI16: R17.1 U18.7(OUTMOSI)
SPI_SCK0: R5.1 R6.2 R11.1 U2.11(INSCK)
SPI_SCK1: U2.6(OUTSCK) U3.11(INSCK)
SPI_SCK2: U3.6(OUTSCK) U4.11(INSCK)
SPI_SCK3: U4.6(OUTSCK) U5.11(INSCK)
SPI_SCK4: U5.6(OUTSCK) U7.11(INSCK)
SPI_SCK5: U7.6(OUTSCK) U8.11(INSCK)
SPI_SCK6: U8.6(OUTSCK) U9.11(INSCK)
SPI_SCK7: U9.6(OUTSCK) U10.11(INSCK)
SPI_SCK8: U10.6(OUTSCK) U11.11(INSCK)
SPI_SCK9: U11.6(OUTSCK) U12.11(INSCK)
SPI_SCK10: U12.6(OUTSCK) U13.11(INSCK)
SPI_SCK11: U13.6(OUTSCK) U14.11(INSCK)
SPI_SCK12: U14.6(OUTSCK) U15.11(INSCK)
SPI_SCK13: U15.6(OUTSCK) U16.11(INSCK)
SPI_SCK14: U16.6(OUTSCK) U17.11(INSCK)
SPI_SCK15: U17.6(OUTSCK) U18.11(INSCK)
SPI_SCK16: U18.6(OUTSCK)
SWN3: C312.2 L2.1 Q4.1(S) Q4.2(S) Q4.3(S) Q5.5(D) Q5.6(D) Q5.7(D) Q5.8(D) Q6.5(D) Q6.6(D) Q6.7(D) Q6.8(D) U30.2(SW)
SWN4: C189.2 L1.1 Q1.1(S) Q1.2(S) Q1.3(S) Q2.5(D) Q2.6(D) Q2.7(D) Q2.8(D) Q3.5(D) Q3.6(D) Q3.7(D) Q3.8(D) R36.2 U25.2(SW)
U2Rx: U1.31(SDA2/PMA9/RP100/RF4)
U2Tx: U1.32(SCL2/PMA8/RP101/RF5)
USB5.0V: J3.1 R46.2 R56.2
USBDM/D-: J3.2 R34.1
USBDP/D+: J3.3 R35.1
USBMCU5.0V: R56.1 R62.1 U1.34(VBUS)
VCAP: C17.1 U1.56(VCAP)
YELLOW: D6.2(A) U1.44(ASCL1/PMCS2/RPI74/RD10)
NetC209_1: C209.1 R36.1 R37.2
NetJ4_2: J4.2 R41.1
NetQ7_1: Q7.1(B) R2.2
NetQ8_1: Q8.1(B) R8.2

Not connected (* = marked no-connect by the designer): J3 4; U1 8(C2IN1-/PMA2/RPI121/RG9) 11(AN5/C1IN1+/VBUSON/VBUSST/RPI37/RB5) 12(AN4/C1IN2-/USBOEN/RPI36/RB4) 21(AN8/PMA6/RPI40/RB8) 22(AN9/PMA7//RPI41/RB9) 23(TMS/AN10/CVREF/PMA13/RPI42/RB10) 24(TDO/AN11/PMA12/RPI43/RB11) 27(TCK/AN12/PMA11/RPI44/RB12) 28(TDI/AN13/PMA10/RPI45/RB13) 29(AN14/PMA1/RPI46/RB14) 30(AN15/PMA0/RPI47/RB15) 33(USBID/RP99/RF3) 46(INT0/DMH/RP64/RD0) 47(PGED2/SOSCI/C3IN3-/RPI61/RC13) 48(PGEC2/SOSCO/C3IN1-/T1CK/RPI62/RC14) 52(PMWR/RP68/RD4) 53(PMRD/RP69/RD5) 54(C3IN2-/RP70/RD6) 55(C3IN1+/VCMPST3/RP71/RD7); U6 4(NC); U19 2(GND) 3(GND) 4(N.C.); U21 5(Vref); U24 2(GND) 3(GND) 4(N.C.)

## Notes on the sheet
- Swapped XCLK1 and XCLK9I
- (near C234) MCU Pins
- (in symbol C_POL) +
- (in symbol CON_USB_MINI_1) gnd

## Library data of the parts
C2-C9 C11-C16 C18-C30 C32 C33 C35-C37 C39-C44 C46 C48-C58 C60-C62 C64 C66-C71 C77-C84 C87-C98 C100 C102 C103 C105-C140 C142 C144-C146 C148-C150 C152-C167 C169-C185 C326-C349 C351-C353 C355 C356 C388-C424 C427-C436 C439-C472 C475-C483 = Cap Semi: Capacitor (Semiconductor SIM Model); Published: 8-Jun-2000; LatestRevisionDate: 29-May-2009; LatestRevisionNote: IPC-7351 Footprint Added.; PackageReference: C1206; Publisher: Altium Limited; PackageDescription: Chip Capacitor; Value: 470nF
C17 C34 C63 C72-C76 C85 C86 C187-C193 C195-C207 C209 C211 C213-C227 C229 C231 C233 C234 C237 C240-C255 C258-C270 C273-C280 C283-C306 C308 C311 C312 C314-C325 = CAP: Capacitor
C208 C210 C272 C281 = C_POL: NOTE: <NOTE>
C228 C238 C239 C256 C257 C271 C282 C307 C309 C313 = C_POL: 姨0J332M-RBJ21; NOTE: <NOTE>
C358-C387 C489 C491 C493-C495 C501 C503-C536 = Cap Semi: CL32A227MQVNNNE 220UF 6.3V 20% X5R 1210; Published: 8-Jun-2000; LatestRevisionDate: 29-May-2009; LatestRevisionNote: IPC-7351 Footprint Added.; PackageReference: C1206; Publisher: Altium Limited; PackageDescription: Chip Capacitor
  C358-C387 C503-C536: Value: (OPT)220uF
  C489 C491 C493-C495 C501: Value: (OPT)100uF
D1-D3 = D_DUAL_A1A2CC3: NOTE: <NOTE>
D4-D7 = LED_2: NOTE: <NOTE>
J1 = CON5: Connector
J2 J6 = CON_4PINS
J3 = CON_USB_MINI_1: NOTE: <NOTE>
J4 J5 = CON2: Connector
L1 L2 = L
Q1-Q6 = MOS_N_D1_S1S2S3G4D5D6D7D8: NOTE: <NOTE>
Q7 Q8 = BJT_NPN_B1E2C3: NOTE: <NOTE>
R1-R18 R24-R31 R34-R38 R40-R47 R56 R57 R59-R64 R79-R86 R103-R110 R127-R134 = Res3: Resistor; Published: 8-Jun-2000; LatestRevisionDate: 29-May-2009; LatestRevisionNote: IPC-7351 Footprint Added.; PackageReference: J1-0603; Publisher: Altium Limited; PackageDescription: Chip Resistor
  R1 R17 R24-R31 R79-R86 R103-R110 R127-R134: Value: 1k
  R2 R12 R46 R47 R56 R60 R63 R64: Value: 0
  R3-R6: Value: 2k
  R7: Value: (OPT)1k
  R8 R13 R16 R18 R42 R62: Value: (OPT)0
  R9 R14 R15 R40 R43 R44 R57 R59: Value: 10k
  R10 R11: Value: (OPT)2k
  R34 R35: Value: 27
  R36: Value: 768
  R37 R38 R45 R61: Value: 2.4k
  R41: Value: 120
U2-U5 U7-U18 = BITFURY256: BitFury SHA256
U6 = VOLTREG LDO
U19 U22 U24 = IC_LM2931AD-5.0R2G_SO-8
U20 U23 = IC_Vout1GND2Vin3: NOTE: <NOTE>
U21 = MCP2551: CAN Driver
U25 U30 = DRVFET_LTC4442: Mosfet 12V Dual Bootstrapped PWM Sync Buck Optimised
Y1 = CRYSTAL